# EAGLE design EthToRS485_V1_AUTO (EAGLE 6.3)
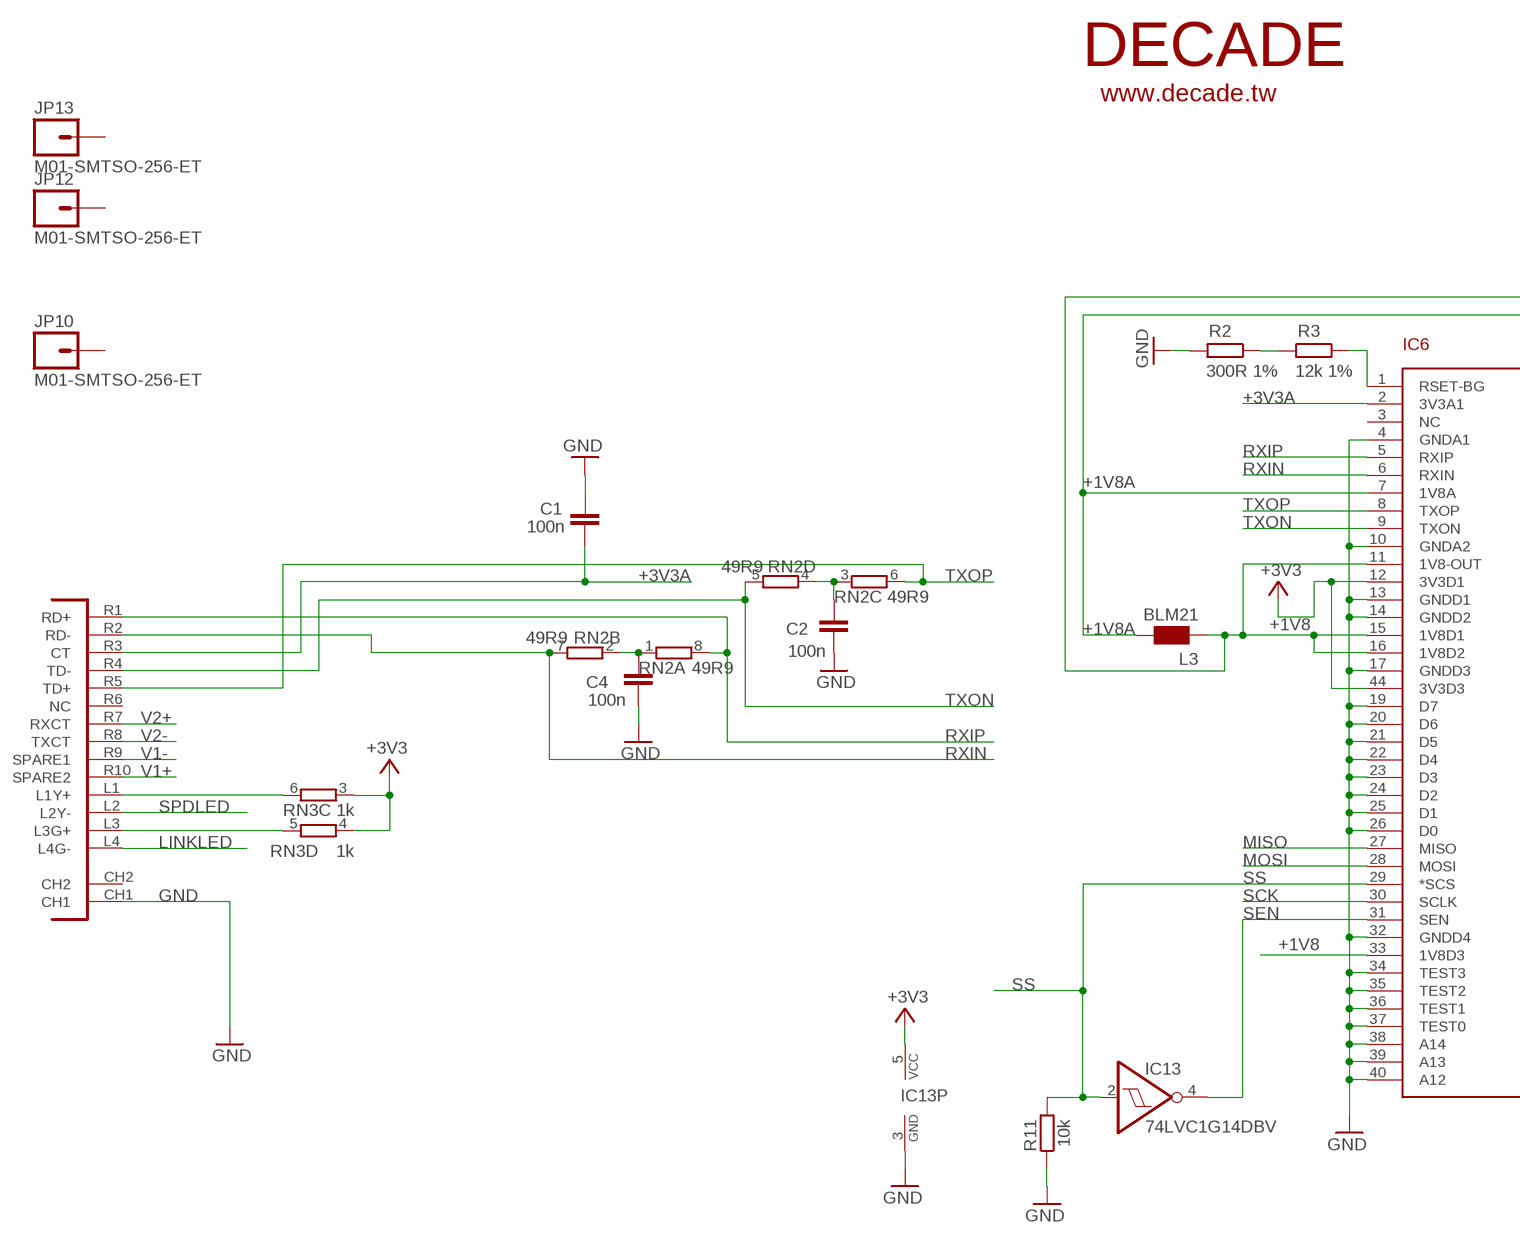
[diagram p0: schematic, sheet 1, part 1 of 3]
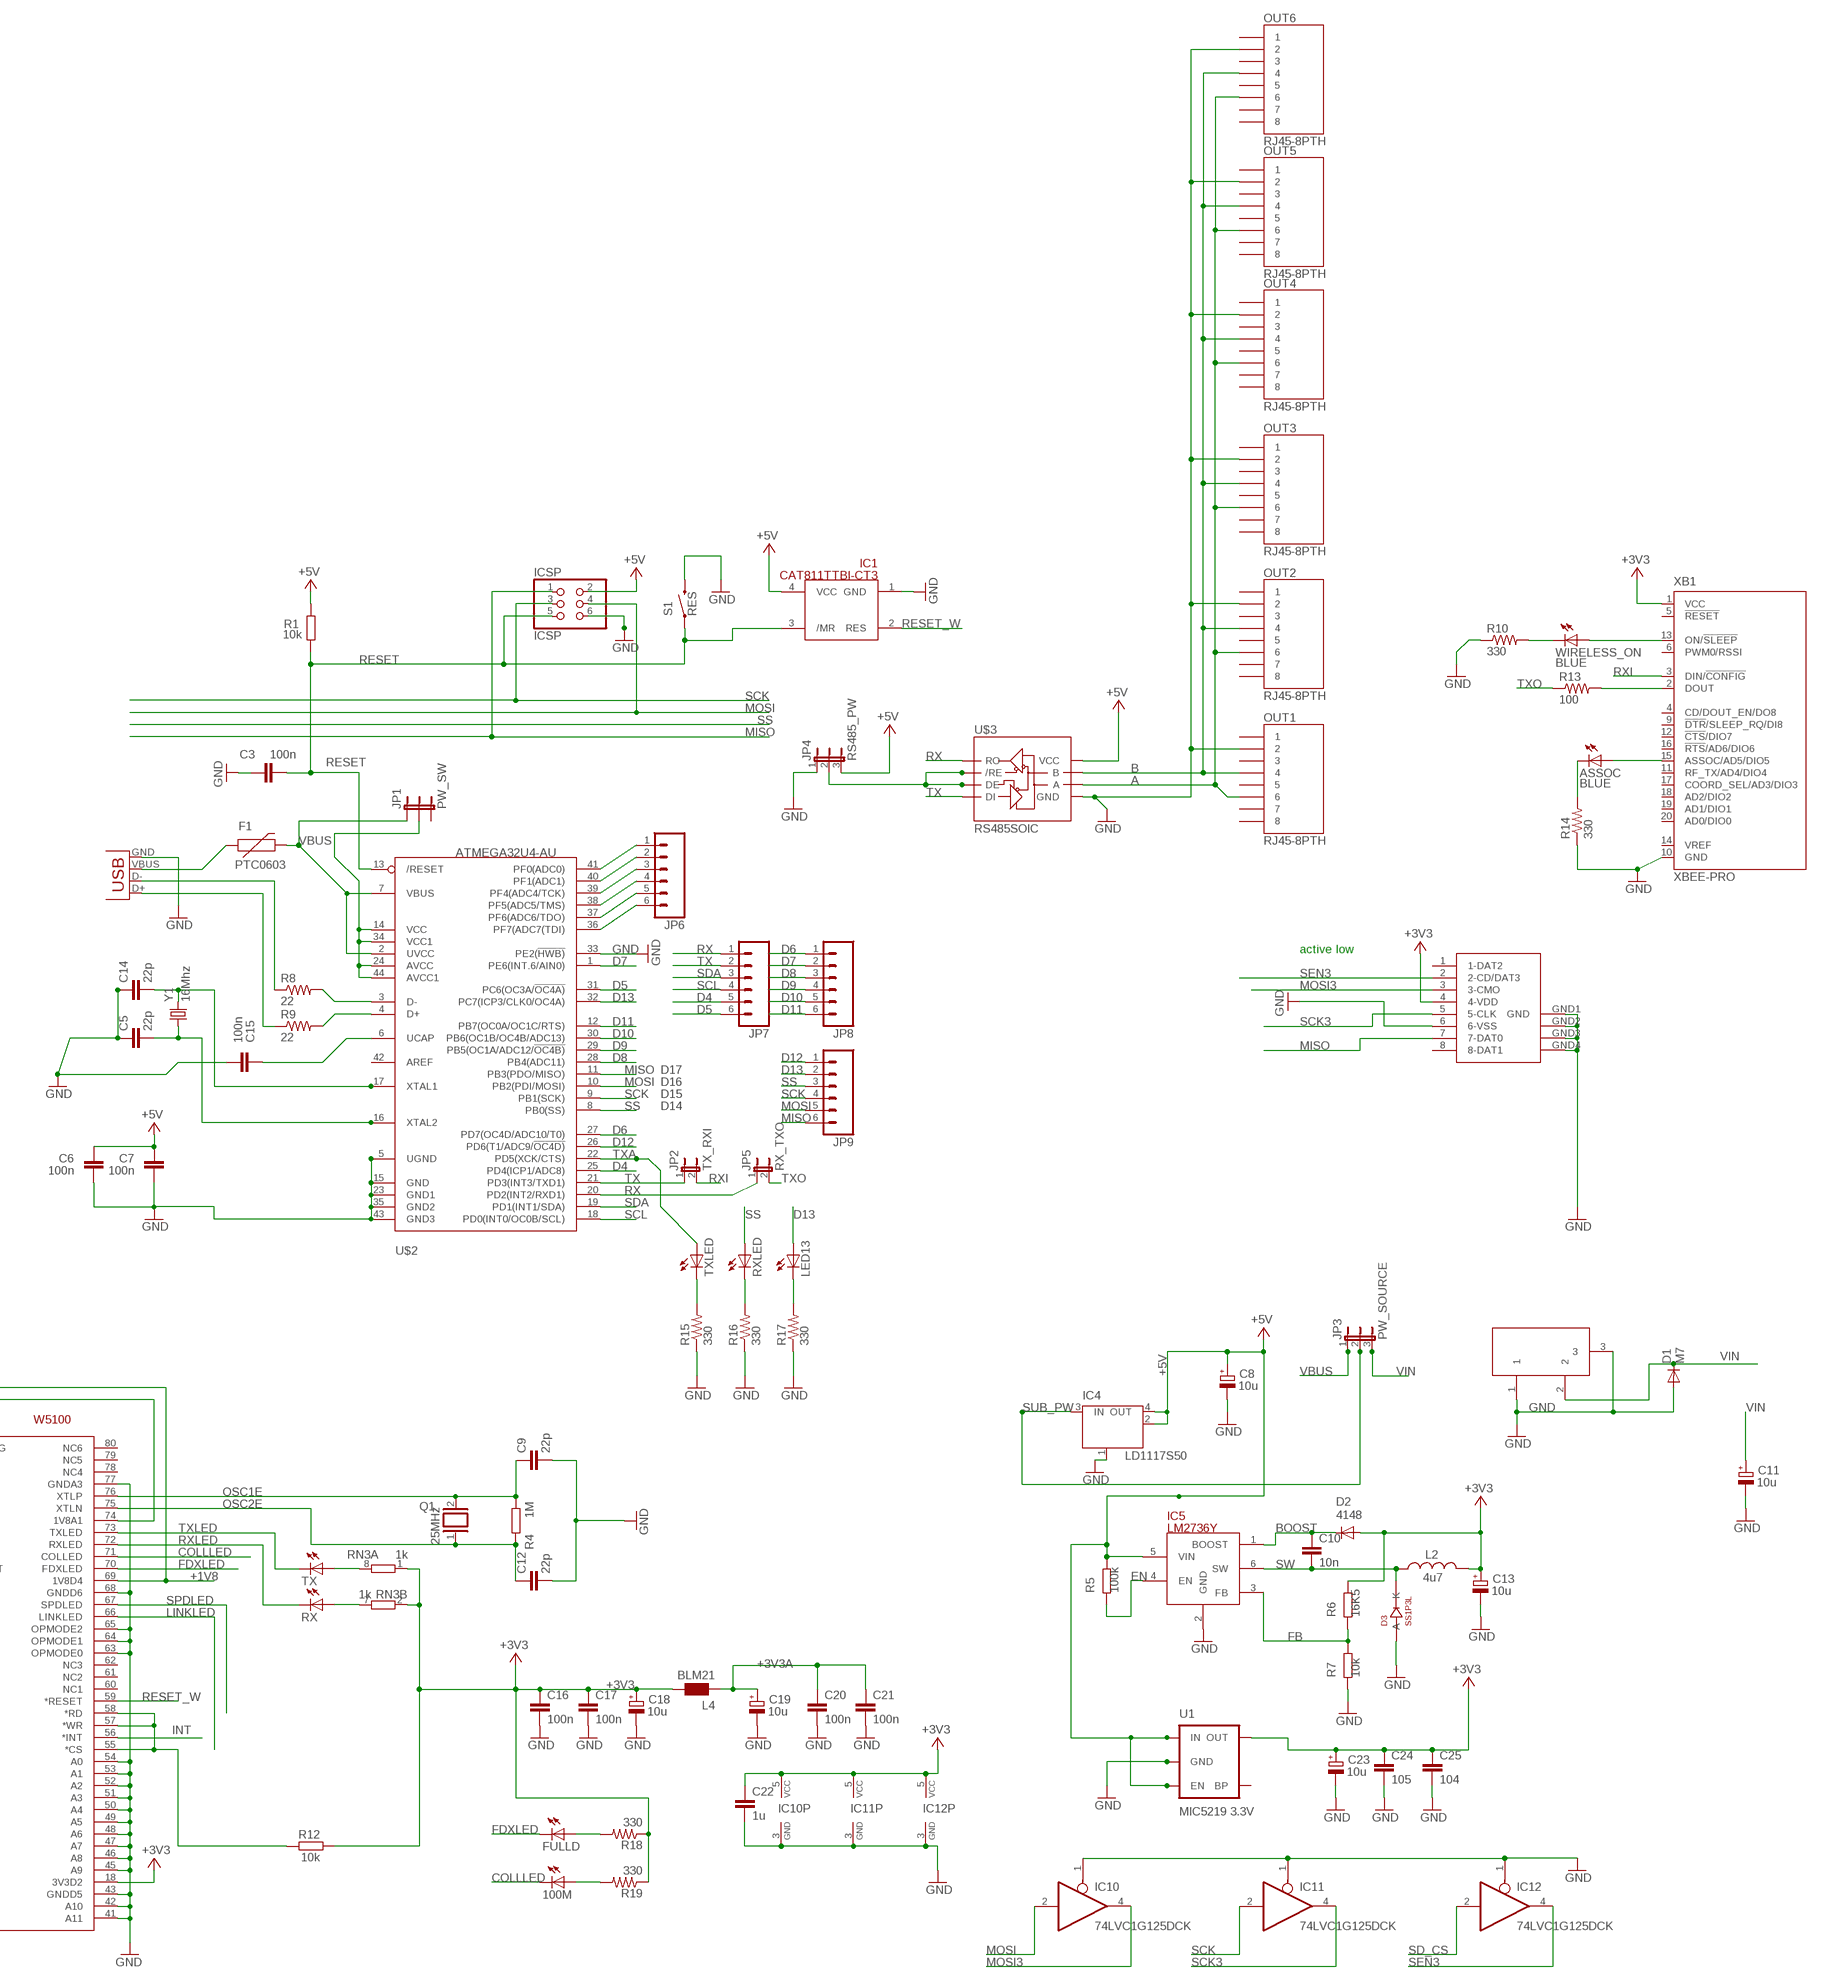
[diagram p1: schematic, sheet 1, part 2 of 3]
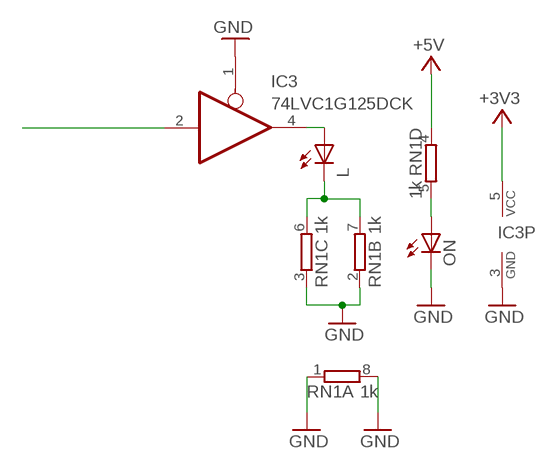
[diagram p2: schematic, sheet 1, part 3 of 3]

## Parts
100M  LEDCHIPLED_0805  [CHIPLED_0805]
ASSOC  BLUE  LEDCHIPLED_0805  [CHIPLED_0805]
C1  100n  C-EUC0603  [C0603-ROUND]
C2  100n  C-EUC0603  [C0603-ROUND]
C3  100n  C-EUC0603  [C0603-ROUND]
C4  100n  C-EUC0603  [C0603-ROUND]
C5  22p  CAP0805  [0805]
C6  100n  C-EUC0603  [C0603-ROUND]
C7  100n  C-EUC0603  [C0603-ROUND]
C8  10u  CPOL-EUSMCB  [SMC_B]
C9  22p  C-EUC0603  [C0603-ROUND]
C10  10n  C-EUC0603  [C0603-ROUND]
C11  10u  CPOL-EUSMCB  [SMC_B]
C12  22p  C-EUC0603  [C0603-ROUND]
C13  10u  CPOL-EUSMCB  [SMC_B]
C14  22p  CAP0805  [0805]
C15  100n  C-EUC0603  [C0603-ROUND]
C16  100n  C-EUC0603  [C0603-ROUND]
C17  100n  C-EUC0603  [C0603-ROUND]
C18  10u  CPOL-EUSMCB  [SMC_B]
C19  10u  CPOL-EUSMCB  [SMC_B]
C20  100n  C-EUC0603  [C0603-ROUND]
C21  100n  C-EUC0603  [C0603-ROUND]
C22  1u  C-EUC0603  [C0603-ROUND]
C23  10u  CPOL-EUSMCB  [SMC_B]
C24  105  C-EUC0603  [C0603-ROUND]
C25  104  C-EUC0603  [C0603-ROUND]
D1  M7  DIODE-SMB  [SMB]
D2  4148  DIODE-MINIMELF  [MINIMELF]
D3  SS1P3L  [DO220AAL]
F1  PTC0603  [0603]
FULLD  LEDCHIPLED_0805  [CHIPLED_0805]
IC1  CAT811TTBI-CT3  STM812  [SOT143]
IC3  74LVC1G125DCK  [SC70-5]
IC4  LD1117S50  MC33269ST-3.3T3  [SOT223]
IC5  LM2736Y  [SOT23-6]
IC6  W5100  [SQFP-S-10X10-80]
IC10  74LVC1G125DCK  [SC70-5]
IC11  74LVC1G125DCK  [SC70-5]
IC12  74LVC1G125DCK  [SC70-5]
IC13  74LVC1G14DBV  [SOT23-5]
ICSP  ICSP  PINHD-2X3  [2X03]
JP1  PW_SW  JUMPER-3SMD  [SJ_3]
JP2  TX_RXI  JP1E  [JP1]
JP3  PW_SOURCE  JP2E  [JP2]
JP4  RS485_PW  JP2E  [JP2]
JP5  RX_TXO  JP1E  [JP1]
JP6  M06SIP  [1X06]
JP7  M06SIP  [1X06]
JP8  M06SIP  [1X06]
JP9  M06SIP  [1X06]
JP10  M01-SMTSO-256-ET  [SMTSO-256-ET]
JP12  M01-SMTSO-256-ET  [SMTSO-256-ET]
JP13  M01-SMTSO-256-ET  [SMTSO-256-ET]
L  LEDCHIPLED_0805  [CHIPLED_0805]
L2  4u7  L-USSRR0604  [SRR0604]
L3  BLM21  WE-CBF_0805  [0805]
L4  BLM21  WE-CBF_0805  [0805]
LED13  LEDCHIPLED_0805  [CHIPLED_0805]
ON  LEDCHIPLED_0805  [CHIPLED_0805]
OUT1  RJ45-8PTH  [RJ45-8]
OUT2  RJ45-8PTH  [RJ45-8]
OUT3  RJ45-8PTH  [RJ45-8]
OUT4  RJ45-8PTH  [RJ45-8]
OUT5  RJ45-8PTH  [RJ45-8]
OUT6  RJ45-8PTH  [RJ45-8]
Q1  25MHz  XTAL/S  [QS]
R1  10k  R-EU_0603-RND  [R0603-ROUND]
R2  300R 1%  R-EU_0603-RND  [R0603-ROUND]
R3  12k 1%  R-EU_0603-RND  [R0603-ROUND]
R4  1M  R-EU_0603-RND  [R0603-ROUND]
R5  100k  R-EU_0603-RND  [R0603-ROUND]
R6  16K5  R-EU_0603-RND  [R0603-ROUND]
R7  10k  R-EU_0603-RND  [R0603-ROUND]
R8  22  RESISTOR0805-RES  [0805]
R9  22  RESISTOR0805-RES  [0805]
R10  330  RESISTOR0805-RES  [0805]
R11  10k  R-EU_0603-RND  [R0603-ROUND]
R12  10k  R-EU_R0603  [R0603-ROUND]
R13  100  RESISTOR0805-RES  [0805]
R14  330  RESISTOR0805-RES  [0805]
R15  330  RESISTOR0805-RES  [0805]
R16  330  RESISTOR0805-RES  [0805]
R17  330  RESISTOR0805-RES  [0805]
R18  330  RESISTOR0805-RES  [0805]
R19  330  RESISTOR0805-RES  [0805]
RN1  1k  4R-NCAY16  [CAY16]
RN2  49R9  4R-NCAY16  [CAY16]
RN3  1k  4R-NCAY16  [CAY16]
RX  LEDCHIPLED_0805  [CHIPLED_0805]
RXLED  LEDCHIPLED_0805  [CHIPLED_0805]
S1  RES  SWITCH-MOMENTARY-2-SMD-1101NE  [TACTILE-SWITCH-1101NE]
TX  LEDCHIPLED_0805  [CHIPLED_0805]
TXLED  LEDCHIPLED_0805  [CHIPLED_0805]
U1  MIC5219 3.3V  V_REG_MIC52193.3V  [SOT23-5]
U$1  POE-RJ45  [POE-RJ45]
U$2  ATMEGA32U4-AU  [TQFP44]
U$3  RS485SOIC  [SO08]
U$4  DECADE-LOGO-SMALL  [DECADE-LOGO-SMALL]
WIRELESS_ON  BLUE  LEDCHIPLED_0805  [CHIPLED_0805]
X1  DC21MMX  [DC-21MM]
X2  SDCARD-15TW-8821  [SDCARD-15TW-8821]
X3  USBOLD  [USB-MINIB-OLD]
XB1  XBEE-PRO  [XBEE-PRO]
Y1  16Mhz  CRYSTAL5X3  [CRYSTAL-SMD-5X3]

## Nets
+1V8 [power]: IC6.11(1V8-OUT) IC6.15(1V8D1) IC6.16(1V8D2) IC6.33(1V8D3) IC6.69(1V8D4) L3.1
+1V8A [power]: IC6.7(1V8A) IC6.74(1V8A1) L3.2
+3V3 [power]: C13.+ C16.1 C17.1 C18.+ C22.1 C23.+ C24.1 C25.1 D2.A IC3.5(VCC) IC6.12(3V3D1) IC6.18(3V3D2) IC6.44(3V3D3) IC10.5(VCC) IC11.5(VCC) IC12.5(VCC) IC13.5(VCC) L2.P$2 L4.2 R6.1 R12.2 R18.1 R19.1 RN3.1 RN3.2 RN3.3 RN3.4 U1.5(OUT) X2.4(4-VDD) XB1.1(VCC)
+3V3A [power]: C1.1 C19.+ C20.1 C21.1 IC6.2(3V3A1) L4.1 U$1.R3(CT)
+5V [power]: C6.1 C7.1 C8.+ IC1.4(VCC) IC4.2(OUT) IC4.4(OUT) IC5.5(VIN) ICSP.2 JP4.3 R1.2 R5.1 RN1.4 U1.1(IN) U1.3(EN) U$3.8(VCC)
A: OUT1.6 OUT2.6 OUT3.6 OUT4.6 OUT5.6 OUT6.6 U$3.6(A)
AD0: JP6.1 U$2.41(PF0(ADC0))
AD1: JP6.2 U$2.40(PF1(ADC1))
AD2: JP6.3 U$2.39(PF4(ADC4/TCK))
AD3: JP6.4 U$2.38(PF5(ADC5/TMS))
AD4: JP6.5 U$2.37(PF6(ADC6/TDO))
AD5: JP6.6 U$2.36(PF7(ADC7(TDI))
B: OUT1.4 OUT2.4 OUT3.4 OUT4.4 OUT5.4 OUT6.4 U$3.7(B)
BOOST: C10.1 D2.C IC5.1(BOOST)
COLLLED: 100M.C IC6.71(COLLED)
D4: JP7.5 U$2.25(PD4(ICP1/ADC8))
D5: JP7.6 U$2.31(PC6(OC3A/!OC4A))
D6: JP8.1 U$2.27(PD7(OC4D/ADC10/T0))
D7: JP8.2 U$2.1(PE6(INT.6/AIN0))
D8: JP8.3 U$2.28(PB4(ADC11))
D9: JP8.4 U$2.29(PB5(OC1A/ADC12/!OC4B))
D10: JP8.5 U$2.30(PB6(OC1B/OC4B/ADC13))
D11: JP8.6 U$2.12(PB7(OC0A/OC1C/RTS))
D12: JP9.1 U$2.26(PD6(T1/ADC9/!OC4D))
D13: JP9.2 LED13.A U$2.32(PC7(ICP3/CLK0/OC4A))
EN: IC5.4(EN) R5.2
FB: IC5.3(FB) R6.2 R7.1
FDXLED: FULLD.C IC6.70(FDXLED)
GND [power]: C1.2 C2.1 C3.2 C4.1 C5.1 C6.2 C7.2 C8.- C9.2 C11.- C12.2 C13.- C14.1 C15.2 C16.2 C17.2 C18.- C19.- C20.2 C21.2 C22.2 C23.- C24.2 C25.2 D1.A D3.P$2(A) IC1.1(GND) IC3.1(OE) IC3.3(GND) IC4.1(GND/ADJ) IC5.2(GND) IC6.4(GNDA1) IC6.10(GNDA2) IC6.13(GNDD1) IC6.14(GNDD2) IC6.17(GNDD3) IC6.19(D7) IC6.20(D6) IC6.21(D5) IC6.22(D4) IC6.23(D3) IC6.24(D2) IC6.25(D1) IC6.26(D0) IC6.32(GNDD4) IC6.34(TEST3) IC6.35(TEST2) IC6.36(TEST1) IC6.37(TEST0) IC6.38(A14) IC6.39(A13) IC6.40(A12) IC6.41(A11) IC6.42(A10) IC6.43(GNDD5) IC6.45(A9) IC6.46(A8) IC6.47(A7) IC6.48(A6) IC6.49(A5) IC6.50(A4) IC6.51(A3) IC6.52(A2) IC6.53(A1) IC6.54(A0) IC6.63(OPMODE0) IC6.64(OPMODE1) IC6.65(OPMODE2) IC6.68(GNDD6) IC6.77(GNDA3) IC10.1(OE) IC10.3(GND) IC11.1(OE) IC11.3(GND) IC12.1(OE) IC12.3(GND) IC13.3(GND) ICSP.6 JP4.1 ON.C OUT1.2 OUT2.2 OUT3.2 OUT4.2 OUT5.2 OUT6.2 R2.2 R7.2 R10.1 R11.1 R14.1 R15.1 R16.1 R17.1 RN1.1 RN1.2 RN1.3 RN1.8 S1.P$2 U1.2(GND) U$1.CH1 U$2.5(UGND) U$2.15(GND) U$2.23(GND1) U$2.33(PE2(!HWB)) U$2.35(GND2) U$2.43(GND3) U$3.5(GND) X1.1 X1.3 X2.6(6-VSS) X2.GND1(GND) X2.GND2(GND1) X2.GND3(GND2) X2.GND4(GND3) X3.GND XB1.10(GND)
INT: IC6.56(*INT)
LINKLED: IC6.66(LINKLED) U$1.L4(L4G-)
MISO: IC6.27(MISO) ICSP.1 JP9.6 U$2.11(PB3(PDO/MISO)) X2.7(7-DAT0)
MOSI: IC6.28(MOSI) IC10.2(I) ICSP.4 JP9.5 U$2.10(PB2(PDI/MOSI))
MOSI3: IC10.4(O) X2.3(3-CMO)
N$1: IC3.4(O) L.A
N$2: RN3.5 U$1.L3(L3G+)
N$3: RN3.6 U$1.L1(L1Y+)
N$4: IC3.2(I)
N$5: L.C RN1.6 RN1.7
N$6: C5.2 U$2.16(XTAL2) Y1.1
N$7: C14.2 U$2.17(XTAL1) Y1.3
N$8: ON.A RN1.5
N$9: RN3.8 TX.A
N$10: C2.2 RN2.3 RN2.4
N$11: R8.2 U$2.3(D-)
N$12: R9.2 U$2.4(D+)
N$13: R8.1 X3.D-
N$14: R9.1 X3.D+
N$15: F1.1 X3.VBUS
N$16: R15.2 TXLED.C
N$17: R13.2 XB1.2(DOUT)
N$18: C15.1 U$2.6(UCAP)
N$19: JP1.2 U$2.14(VCC) U$2.24(AVCC) U$2.34(VCC1) U$2.44(AVCC1)
N$20: R10.2 WIRELESS_ON.C
N$21: JP4.2 U$3.2(/RE) U$3.3(DE)
N$22: RN3.7 RX.A
N$23: WIRELESS_ON.A XB1.13(ON/!SLEEP)
N$24: ASSOC.A XB1.15(ASSOC/AD5/DIO5)
N$25: ASSOC.C R14.2
N$26: FULLD.A R18.2
N$29: C4.2 RN2.1 RN2.2
N$30: R2.1 R3.2
N$31: IC6.1(RSET-BG) R3.1
N$36: IC6.55(*CS) IC6.57(*WR) IC6.58(*RD) R12.1
N$37: R16.2 RXLED.C
N$38: LED13.C R17.2
N$39: 100M.A R19.2
OSC1E: C9.1 IC6.76(XTLP) Q1.2 R4.1
OSC2E: C12.1 IC6.75(XTLN) Q1.1 R4.2
RESET: C3.1 IC1.3(/MR) ICSP.5 R1.1 S1.P$1 U$2.13(/RESET)
RESET_W: IC1.2(RES) IC6.59(*RESET)
RX: JP5.1 JP7.1 U$2.20(PD2(INT2/RXD1)) U$3.1(RO)
RXI: JP2.2 XB1.3(DIN/!CONFIG)
RXIN: IC6.6(RXIN) RN2.7 U$1.R2(RD-)
RXIP: IC6.5(RXIP) RN2.8 U$1.R1(RD+)
RXLED: IC6.72(RXLED) RX.C
SCK: IC6.30(SCLK) IC11.2(I) ICSP.3 JP9.4 U$2.9(PB1(SCK))
SCK3: IC11.4(O) X2.5(5-CLK)
SCL: JP7.4 U$2.18(PD0(INT0/OC0B/SCL))
SD_CS: IC12.2(I)
SDA: JP7.3 U$2.19(PD1(INT1/SDA))
SEN: IC6.31(SEN) IC13.4(O)
SEN3: IC12.4(O) X2.2(2-CD/DAT3)
SPDLED: IC6.67(SPDLED) U$1.L2(L2Y-)
SS: IC6.29(*SCS) IC13.2(I) JP9.3 R11.2 RXLED.A U$2.8(PB0(SS))
SUB_PW [VIN]: IC4.3(IN) JP3.2
SW [power]: C10.2 D3.P$1(K) IC5.6(SW) L2.P$1
TX: JP2.1 JP7.2 U$2.21(PD3(INT3/TXD1)) U$3.4(DI)
TXA: TXLED.A U$2.22(PD5(XCK/CTS))
TXLED: IC6.73(TXLED) TX.C
TXO: JP5.2 R13.1
TXON: IC6.9(TXON) RN2.5 U$1.R4(TD-)
TXOP: IC6.8(TXOP) RN2.6 U$1.R5(TD+)
V1+ [VIN]: U$1.R10(SPARE2)
V1- [VIN]: U$1.R9(SPARE1)
V2+ [VIN]: U$1.R7(RXCT)
V2- [VIN]: U$1.R8(TXCT)
VBUS: F1.2 JP1.1 JP3.1 U$2.2(UVCC) U$2.7(VBUS)
VIN [VIN]: C11.+ D1.C JP3.3 X1.2
Unconnected: IC6.3(NC) IC6.60(NC1) IC6.61(NC2) IC6.62(NC3) IC6.78(NC4) IC6.79(NC5) IC6.80(NC6) JP1.3 JP10.P$1 JP12.P$1 JP13.P$1 OUT1.1 OUT1.3 OUT1.5 OUT1.7 OUT1.8 OUT2.1 OUT2.3 OUT2.5 OUT2.7 OUT2.8 OUT3.1 OUT3.3 OUT3.5 OUT3.7 OUT3.8 OUT4.1 OUT4.3 OUT4.5 OUT4.7 OUT4.8 OUT5.1 OUT5.3 OUT5.5 OUT5.7 OUT5.8 OUT6.1 OUT6.3 OUT6.5 OUT6.7 OUT6.8 U1.4(BP) U$1.CH2 U$1.R6(NC) U$2.42(AREF) X2.1(1-DAT2) X2.8(8-DAT1) XB1.4(CD/DOUT_EN/DO8) XB1.5(!RESET) XB1.6(PWM0/RSSI) XB1.9(!DTR!/SLEEP_RQ/DI8) XB1.11(RF_TX/AD4/DIO4) XB1.12(!CTS!/DIO7) XB1.14(VREF) XB1.16(!RTS!/AD6/DIO6) XB1.17(COORD_SEL/AD3/DIO3) XB1.18(AD2/DIO2) XB1.19(AD1/DIO1) XB1.20(AD0/DIO0)

## Notes on the sheet
- active low
- D17
- D16
- D15
- D14

## Library data of the parts
100M ASSOC FULLD L LED13 ON RX RXLED TX TXLED WIRELESS_ON = led:LED: LED OSRAM: - CHIPLED LG R971, LG N971, LY N971, LG Q971, LY Q971, LO R971, LY R971 LH N974, LH R974 LS Q976, LO Q976, LY Q976 LO Q996 - Hyper CHIPLED LW Q18S LB Q993, LB Q99A, LB R99A - SideLED LS A670, LO A670, LY A670, LG A670, LP A670 LB A673, LV A673, LT A673, LW A673 LH A674 LY A675 LS A676, LA A676, LO A676, LY A676, LW A676 LS A679, LY A679, LG A679 - Hyper Micro SIDELED® LS Y876, LA Y876, LO Y876, LY Y876 LT Y87S - SmartLED LW L88C, LW L88S LB L89C, LB L89S, LG L890 LS L89K, LO L89K, LY L89K LS L896, LA L896, LO L896, LY L896 - TOPLED LS T670, LO T670, LY T670, LG T670, LP T670 LSG T670, LSP T670, LSY T670, LOP T670, LYG T670 LG T671, LOG T671, LSG T671 LB T673, LV T673, LT T673, LW T673 LH T674 LS T676, LA T676, LO T676, LY T676, LB T676, LH T676, LSB T676, LW T676 LB T67C, LV T67C, LT T67C, LS T67K, LO T67K, LY T67K, LW E67C LS E67B, LA E67B, LO E67B, LY E67B, LB E67C, LV E67C, LT E67C LW T67C LS T679, LY T679, LG T679 LS T770, LO T770, LY T770, LG T770, LP T770 LB T773, LV T773, LT T773, LW T773 LH T774 LS E675, LA E675, LY E675, LS T675 LS T776, LA T776, LO T776, LY T776, LB T776 LHGB T686 LT T68C, LB T68C - Hyper Mini TOPLED® LB M676 - Mini TOPLED Santana® LG M470 LS M47K, LO M47K, LY M47K Source: http://www.osram.convergy.de LUXEON: - LUMILED® LXK2-PW12-R00, LXK2-PW12-S00, LXK2-PW14-U00, LXK2-PW14-V00 LXK2-PM12-R00, LXK2-PM12-S00, LXK2-PM14-U00 LXK2-PE12-Q00, LXK2-PE12-R00, LXK2-PE12-S00, LXK2-PE14-T00, LXK2-PE14-U00 LXK2-PB12-K00, LXK2-PB12-L00, LXK2-PB12-M00, LXK2-PB14-N00, LXK2-PB14-P00, LXK2-PB14-Q00 LXK2-PR12-L00, LXK2-PR12-M00, LXK2-PR14-Q00, LXK2-PR14-R00 LXK2-PD12-Q00, LXK2-PD12-R00, LXK2-PD12-S00 LXK2-PH12-R00, LXK2-PH12-S00 LXK2-PL12-P00, LXK2-PL12-Q00, LXK2-PL12-R00 Source: www.luxeon.com KINGBRIGHT: KA-3528ASYC Source: www.kingbright.com
C1-C4 C6 C7 C9 C10 C12 C15-C17 C20-C22 C24 C25 = SmartPrj:C-EU: CAPACITOR, European symbol
C5 C14 = SparkFun-Passives:CAP: Capacitor Standard 0603 ceramic capacitor, and 0.1" leaded capacitor.
C8 C11 C13 C18 C19 C23 = rcl:CPOL-EU: POLARIZED CAPACITOR, European symbol
D1 D2 = diode:DIODE-: DIODE
D3 = SmartPrj:SS1P3L
F1 = SparkFun-PowerIC:PTC: Resettable Fuse PTC Resettable Fuse. Spark Fun Electronics SKU : COM-08357
IC1 = SmartPrj:STM812
IC3 IC10-IC12 = 74xx-little-us:74*1G125: Single Bus Buffer Gate with 3-State Output
IC4 = linear:MC33269ST*: Adjustable Output Low Dropout Voltage Regulator 800 mA Source: http://www.onsemi.com/pub/Collateral/MC33269-D.PDF
IC5 = SmartPrj:LM2736Y
IC6 = SmartPrj:W5100
IC13 = 74xx-little-de:74*1G14: Single Schmitt-Trigger Inverter Gate
ICSP = pinhead:PINHD-2X3: PIN HEADER
JP1 = SparkFun-Passives:JUMPER-3
JP2 JP5 = jumper:JP1E: JUMPER
JP3 JP4 = jumper:JP2E: JUMPER
JP6-JP9 = SparkFun-Connectors:M06: Header 6 Standard 6-pin 0.1" header. Use with straight break away headers (SKU : PRT-00116), right angle break away headers (PRT-00553), swiss pins (PRT-00743), machine pins (PRT-00117), and female headers (PRT-00115). Molex polarized connector foot print use with SKU : PRT-08094 with associated crimp pins and housings. NOTES ON THE VARIANTS LOCK and LOCK_LONGPADS... This footprint was designed to help hold the alignment of a through-hole component (i.e. 6-pin header) while soldering it into place. You may notice that each hole has been shifted either up or down by 0.005 of an inch from it's more standard position (which is a perfectly straight line). This slight alteration caused the pins (the squares in the middle) to touch the edges of the holes. Because they are alternating, it causes a "brace" to hold the component in place. 0.005 has proven to be the perfect amount of "off-center" position when using our standard breakaway headers. Although looks a little odd when you look at the bare footprint, once you have a header in there, the alteration is very hard to notice. Also, if you push a header all the way into place, it is covered up entirely on the bottom side. This idea of altering the position of holes to aid alignment will be further integrated into the Sparkfun Library for other footprints. It can help hold any component with 3 or more connection pins.
JP10 JP12 JP13 = SparkFun-Connectors:M01: Header 1 Standard 1-pin 0.1" header. Use with straight break away headers (SKU : PRT-00116), right angle break away headers (PRT-00553), swiss pins (PRT-00743), machine pins (PRT-00117), and female headers (PRT-00115).
L2 = SmartPrj:L-US: INDUCTOR, American symbol
L3 L4 = wuerth-elektronik:WE-CBF: SMD EMI Suppression Ferrite Beads - excellent anti-EMI properties - low DCR - impedances till 3000 ohms - rated current up to 6 A
OUT1-OUT6 = SparkFun-Connectors:RJ45-8: RJ45 Jack Simple RJ45, 8-pin connection - connector for common Cat5, Cat5e, and Cat6 Ethernet cables. Footprint not yet proven in production. Connector sku is PRT-00643; Breakout PCB sku is BOB-00716.
Q1 = special:XTAL/S: CRYSTAL
R1-R7 R11 R12 = SmartPrj:R-EU_: RESISTOR, European symbol
R8-R10 R13-R19 = SparkFun-Passives:RESISTOR: Resistor Basic schematic elements and footprints for 0603, 1206, and PTH resistors.
RN1-RN3 = resistor-dil:4R-N: Array Chip Resistor Source: RS Component / Phycomp
S1 = SparkFun-Electromechanical:SWITCH-MOMENTARY-2: Various NO switches- pushbuttons, reed, etc
U1 = SparkFun-PowerIC:V_REG_MIC5219: V_REG MIC5219 Standard 500mA LDO voltage regulator in SOT-23 layout. Micrel part MIC5219. BP (by-pass) pin is used to lower output noise with 470pF cap, may be left open.; PROD_ID: VREG-09872
U$1 = SmartPrj:POE-RJ45
U$2 = adafruit:ATMEGA32U4: http://www.ladyada.net/library/eagle
U$3 = SparkFun-DigitalIC:RS485: RS485 transceiver
U$4 = DECADE-libraries:DECADE-LOGO-SMALL
X1 = powersupply:DC21MM
X2 = st-mod v1.3:SDCARD-15TW-8821: SD Card SDCARD 15TW 8821
X3 = SparkFun-Connectors:USB: USB Connectors USB-B-PTH is fully proven SKU : PRT-00139 USB-miniB is fully proven SKU : PRT-00587 USB-A-PCB is untested. USB-A-H is throughly reviewed, but untested. Spark Fun Electronics SKU : PRT-00437 USB-B-SMT is throughly reviewed, but untested. Needs silkscreen touching up. USB-A-S has not been used/tested USB-MB-H has not been used/tested
XB1 = maxstream:XBEE: XBee (TM) /XBee-PRO(TM) OEM RF Modules Source: MaxStream, Inc. xbee_productmanual.pdf; MPN: XBP24-AWI-001; OC_FARNELL: 1337916; OC_NEWARK: 42M2667
Y1 = SparkFun-FreqCtrl:CRYSTAL: Various standard crystals. Proven footprints. Spark Fun Electronics SKU : COM-00534

## Net classes
0 default: width 0.152 mm, drill 0.152 mm, clearance 0.152 mm
1 power: width 0.152 mm, drill 0.152 mm, clearance 0.152 mm
2 VIN: width 0.152 mm, drill 0.152 mm, clearance 0.305 mm

## Board
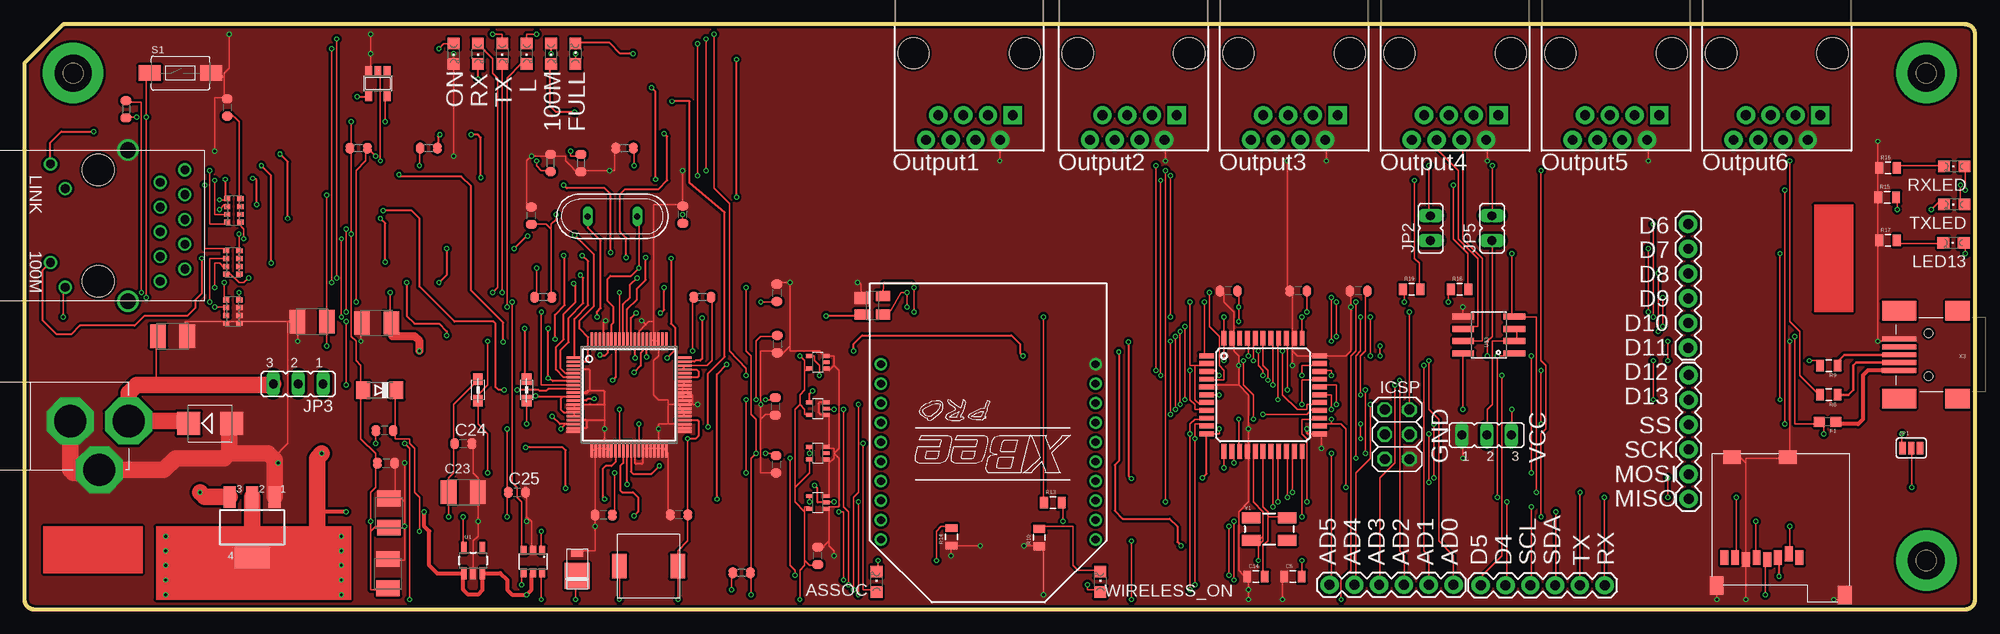
[diagram p3: board, top side]
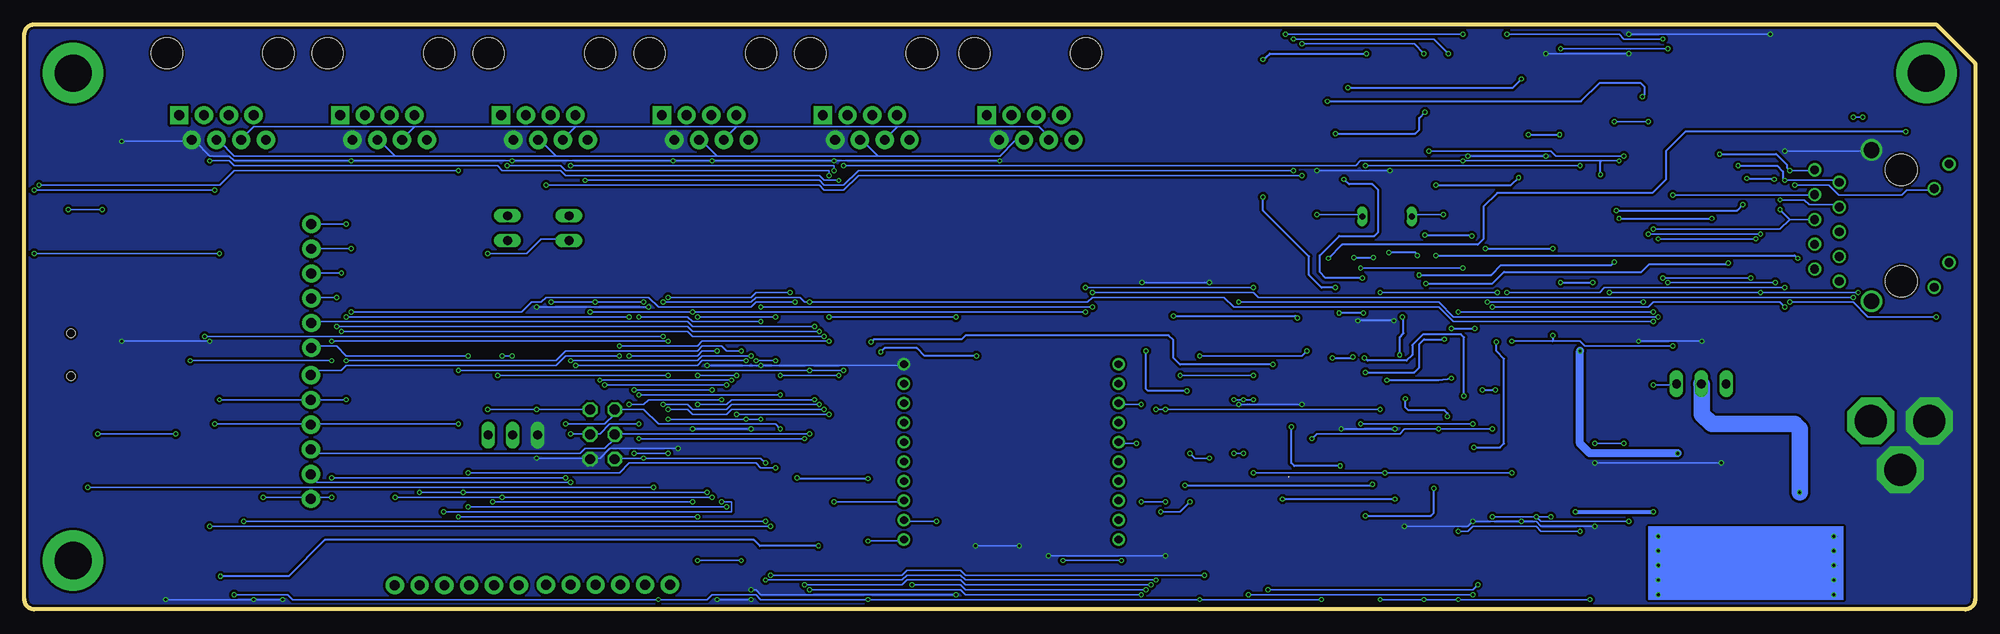
[diagram p4: board, bottom side, seen from below]

Size 200 x 60 mm. Coordinates in mm from the lower left corner, seen from the top.
Outline: 0,56 0,1 arc90 1,0 199,0 arc90 200,1 200,59 arc90 199,60 4,60 0,56
Copper layers (1*16): Top 0.035mm / dielectric 1.5mm / Bottom 0.035mm
Design rules "Fast_ChinaPCB-2012-6mil-off-MASK": minimum track width 6mil, minimum drill 0.3mm, track to track 6mil, track to pad 6mil, pad to pad 6mil, via to via 6mil, smd to smd 6mil, copper to edge 10mil, drill to drill 15mil, minimum pad ring 8mil, minimum via ring 4mil, stop-mask expansion 2mil, vias tented up to drill 13mil, thermal gap 10mil

### Footprints (pad centres in the part's own frame; a part is rotated, then mirrored left to right if it is on the bottom)
CHIPLED_0805 = smd 1.2 x 1.2: A 0,-1.05; C 0,1.05
C0603-ROUND = smd 0.898 x 1.1: 1 -0.889,0; 2 0.889,0
0805 = smd 0.8 x 1.2: 1 -0.9,0; 2 0.9,0
SMC_B = smd 1.6 x 2.4: + -1.5,0; - 1.5,0
SMB = smd 2.4 x 2.4: A 2.2,0; C -2.2,0
MINIMELF = smd 1.4 x 1.8: A 1.7,0; C -1.7,0
DO220AAL = smd 2.667 x 2.54: P$1 -0.7,0 | smd 0.762 x 1.27: P$2 1.65,0
0603 = smd 1.1 x 1: 1 -0.85,0; 2 0.85,0
SOT143 = smd 1.2 x 1.44: 1 -0.75,-1.1 | smd 1 x 1.44: 2 0.95,-1.1; 3 0.95,1.1; 4 -0.95,1.1
SC70-5 = smd 0.4 x 0.7: 1 -0.65,-0.85; 2 0,-0.85; 3 0.65,-0.85; 4 0.65,0.85; 5 -0.65,0.85
SOT223 = smd 1.219 x 2.235: 1 -2.311,-3.099; 2 0,-3.099; 3 2.311,-3.099 | smd 3.6 x 2.2: 4 0,3.099
SOT23-6 = smd 0.6 x 0.9: 1 -0.95,-1.15; 2 0,-1.15; 3 0.95,-1.15; 4 0.95,1.15; 5 0,1.15; 6 -0.95,1.15
SQFP-S-10X10-80 = smd 0.25 x 1.6: 1 -3.8,-5.6; 2 -3.4,-5.6; 3 -3,-5.6; 4 -2.6,-5.6; 5 -2.2,-5.6; 6 -1.8,-5.6; 7 -1.4,-5.6; 8 -1,-5.6; 9 -0.6,-5.6; 10 -0.2,-5.6; 11 0.2,-5.6; 12 0.6,-5.6; 13 1,-5.6; 14 1.4,-5.6; 15 1.8,-5.6; 16 2.2,-5.6; 17 2.6,-5.6; 18 3,-5.6; 19 3.4,-5.6; 20 3.8,-5.6; 41 3.8,5.6; 42 3.4,5.6; 43 3,5.6; 44 2.6,5.6; 45 2.2,5.6; 46 1.8,5.6; 47 1.4,5.6; 48 1,5.6; 49 0.6,5.6; 50 0.2,5.6; 51 -0.2,5.6; 52 -0.6,5.6; 53 -1,5.6; 54 -1.4,5.6; 55 -1.8,5.6; 56 -2.2,5.6; 57 -2.6,5.6; 58 -3,5.6; 59 -3.4,5.6; 60 -3.8,5.6 | smd 1.6 x 0.25: 21 5.6,-3.8; 22 5.6,-3.4; 23 5.6,-3; 24 5.6,-2.6; 25 5.6,-2.2; 26 5.6,-1.8; 27 5.6,-1.4; 28 5.6,-1; 29 5.6,-0.6; 30 5.6,-0.2; 31 5.6,0.2; 32 5.6,0.6; 33 5.6,1; 34 5.6,1.4; 35 5.6,1.8; 36 5.6,2.2; 37 5.6,2.6; 38 5.6,3; 39 5.6,3.4; 40 5.6,3.8; 61 -5.6,3.8; 62 -5.6,3.4; 63 -5.6,3; 64 -5.6,2.6; 65 -5.6,2.2; 66 -5.6,1.8; 67 -5.6,1.4; 68 -5.6,1; 69 -5.6,0.6; 70 -5.6,0.2; 71 -5.6,-0.2; 72 -5.6,-0.6; 73 -5.6,-1; 74 -5.6,-1.4; 75 -5.6,-1.8; 76 -5.6,-2.2; 77 -5.6,-2.6; 78 -5.6,-3; 79 -5.6,-3.4; 80 -5.6,-3.8
SOT23-5 = smd 0.69 x 0.99: 1 -0.95,-1.29; 2 0,-1.29; 3 0.95,-1.29; 4 0.95,1.3; 5 -0.95,1.3
2X03 = drill 1.016 octagon: 1 -2.54,-1.27; 2 -2.54,1.27; 3 0,-1.27; 4 0,1.27; 5 2.54,-1.27; 6 2.54,1.27
SJ_3 = smd 0.635 x 1.27: 1 -0.889,0; 2 0,0; 3 0.889,0
JP1 = drill 0.914 long: 1 0,-1.27; 2 0,1.27
JP2 = drill 0.914 long: 1 -2.54,0; 2 0,0; 3 2.54,0
1X06 = drill 1.016 pad 1.88: 1 0,0; 2 2.54,0; 3 5.08,0; 4 7.62,0; 5 10.16,0; 6 12.7,0
SMTSO-256-ET = drill 3.81 pad 6.198: P$1 0,0
SRR0604 = smd 1.5 x 2.5: P$1 3,0; P$2 -3,0
0805' = smd 1.2 x 1: 1 -1.1,0; 2 1.1,0
RJ45-8 = drill 1 pad 1.88 square: 1 -4.445,6.35 | drill 1 pad 1.88: 2 -3.175,8.89; 3 -1.905,6.35; 4 -0.635,8.89; 5 0.635,6.35; 6 1.905,8.89; 7 3.175,6.35; 8 4.445,8.89 | hole 3.2: -5.715,0; 5.715,0
QS = drill 0.61 long: 1 -2.54,0; 2 2.54,0
R0603-ROUND = smd 0.898 x 1.1: 1 -0.889,0; 2 0.889,0
CAY16 = smd 0.5 x 0.65: 1 -1.2,-0.675; 2 -0.4,-0.675; 3 0.4,-0.675; 4 1.2,-0.675; 5 1.2,0.675; 6 0.4,0.675; 7 -0.4,0.675; 8 -1.2,0.675
TACTILE-SWITCH-1101NE = smd 2.3 x 1.6: P$1 -3.15,0; P$2 3.15,0
SOT23-5' = smd 0.55 x 1.2: 1 -0.95,-1.3; 2 0,-1.3; 3 0.95,-1.3; 4 0.95,1.3; 5 -0.95,1.3
POE-RJ45 = drill 1.6: CH1 13.94,7.75; CH2 13.94,-7.75 | drill 0.9: L1 7.51,-6.325; L2 5.99,-3.785; L3 7.51,3.785; L4 5.99,6.325; R1 19.77,5.715; R2 17.23,4.445; R3 19.77,3.175; R4 17.23,1.905; R5 19.77,0.635; R6 17.23,-0.635; R7 19.77,-1.905; R8 17.23,-3.175; R9 19.77,-4.445; R10 17.23,-5.715 | hole 3.25: 10.89,5.715; 10.89,-5.715
TQFP44 = smd 1.5 x 0.5: 1 -5.8,4; 2 -5.8,3.2; 3 -5.8,2.4; 4 -5.8,1.6; 5 -5.8,0.8; 6 -5.8,0; 7 -5.8,-0.8; 8 -5.8,-1.6; 9 -5.8,-2.4; 10 -5.8,-3.2; 11 -5.8,-4; 23 5.8,-4; 24 5.8,-3.2; 25 5.8,-2.4; 26 5.8,-1.6; 27 5.8,-0.8; 28 5.8,0; 29 5.8,0.8; 30 5.8,1.6; 31 5.8,2.4; 32 5.8,3.2; 33 5.8,4 | smd 0.5 x 1.5: 12 -4,-5.8; 13 -3.2,-5.8; 14 -2.4,-5.8; 15 -1.6,-5.8; 16 -0.8,-5.8; 17 0,-5.8; 18 0.8,-5.8; 19 1.6,-5.8; 20 2.4,-5.8; 21 3.2,-5.8; 22 4,-5.8; 34 4,5.8; 35 3.2,5.8; 36 2.4,5.8; 37 1.6,5.8; 38 0.8,5.8; 39 0,5.8; 40 -0.8,5.8; 41 -1.6,5.8; 42 -2.4,5.8; 43 -3.2,5.8; 44 -4,5.8
SO08 = smd 0.61 x 2.21: 1 -1.905,-2.616; 2 -0.635,-2.616; 3 0.635,-2.616; 4 1.905,-2.616; 5 1.905,2.616; 6 0.635,2.616; 7 -0.635,2.616; 8 -1.905,2.616
DC-21MM = drill 3.302 pad 4.826 octagon: 1 -5.08,-3.353; 2 -0.076,-6.35; 3 -0.076,-0.356
SDCARD-15TW-8821 = smd 0.8 x 1.5: 1 0,0; 2 1.1,-0.4; 3 2.2,0; 4 3.3,0.2; 5 4.4,0; 6 5.5,0.2; 7 6.6,0; 8 7.7,0 | smd 1.4 x 1.9: GND1 -4.66,3.85; GND2 8.49,2.85 | smd 1.8 x 1.4: GND3 1.19,-10.3; GND4 6.89,-10.3
USB-MINIB-OLD = smd 2.5 x 2: 1 -3,-4.5; 2 -3,4.5 | smd 3.5 x 2: 3 3,-4.5; 4 3,4.5 | smd 3.5 x 0.5: D+ 3,0; D- 3,0.8; GND 3,-1.6; ID 3,-0.8; VBUS 3.01,1.61 | hole 0.9: 0,2.2; 0,-2.2
XBEE-PRO = drill 0.8 pad 1.27: 1 -11,9; 2 -11,7; 3 -11,5; 4 -11,3; 5 -11,1; 6 -11,-1; 7 -11,-3; 8 -11,-5; 9 -11,-7; 10 -11,-9; 11 11,-9; 12 11,-7; 13 11,-5; 14 11,-3; 15 11,-1; 16 11,1; 17 11,3; 18 11,5; 19 11,7; 20 11,9
CRYSTAL-SMD-5X3 = smd 1.9 x 1.1: 1 -1.85,-1.15; 2 1.85,-1.15; 3 1.85,1.15; 4 -1.85,1.15

### Placement (x,y rotation side)
100M  54,57 180 top
ASSOC  87.37,2.82 0 top
C1  59.4,9.67 180 top
C2  20.8,51.46 270 top
C3  123.47,32.65 180 top
C4  77.14,32.46 270 top
C5  130.06,3.35 0 top
C6  77.08,14.87 270 top
C7  130.61,32.65 180 top
C8  36.11,29.36 180 top
C9  51.99,40.38 90 top
C10  36.93,18.32 180 top
C11  15.2,28.03 0 top
C12  67.51,40.48 90 top
C13  37.37,9.88 90 top
C14  126.27,3.35 0 top
C15  136.8,32.65 180 top
C16  37.07,15 0 top
C17  67.12,9.69 180 top
C18  37.29,3.65 90 top
C19  29.5,29.5 180 top
C20  77.19,27.19 270 top
C21  76.99,20.81 270 top
C22  81.34,5.48 90 top
C23  45,12 0 top
C24  45,17 0 top
C25  50.5,12 0 top
D1  19.05,19.07 0 top
D2  36.44,22.47 180 top
D3  56.67,4.13 90 top
F1  184.87,19.22 180 top
FULLD  56.5,57 0 top
IC1  86.93,31.19 270 top
IC3  81.35,25.35 90 top
IC4  23.35,8.41 180 top
IC5  52.15,4.89 180 top
IC6  62,22 270 top
IC10  81.35,20.57 90 top
IC11  81.35,10.95 90 top
IC12  81.35,16.02 90 top
IC13  36.25,53.94 180 top
ICSP  140.74,17.94 270 top
JP1  193.46,16.54 0 top
JP2  144.17,39.09 0 top
JP3  28.07,23.13 180 top
JP4  149.93,17.87 0 top
JP5  150.47,39.09 0 top
JP6  146.52,2.51 180 top
JP7  162.02,2.46 180 top
JP8  170.58,39.52 270 top
JP9  170.63,24.02 270 top
JP10  195,5 0 top
JP12  195,55 0 top
JP13  5,55 0 top
L  51.5,57 180 top
L2  64,4.42 180 top
L3  BLM21  [0805']  51.5,22.5 90 top
L4  BLM21  [0805']  46.5,22.5 90 top
LED13  197.79,37.59 90 top
ON  44,57 180 top
OUT1  96.88,57.03 180 top
OUT2  113.7,57.03 180 top
OUT3  130.19,57.03 180 top
OUT4  146.69,57.03 180 top
OUT5  163.18,57.03 180 top
OUT6  179.68,57.03 180 top
Q1  60.3,40.3 180 top
R1  10.43,51.28 90 top
R2  61.54,47.31 180 top
R3  41.46,47.31 180 top
R4  53.2,32.01 180 top
R5  73.53,3.74 180 top
R6  34.27,47.29 0 top
R7  57.06,45.77 270 top
R8  185,22 180 top
R9  185,25 180 top
R10  104.05,7.37 90 top
R11  53.94,45.77 270 top
R12  69.53,32.01 180 top
R13  105.44,10.95 0 top
R14  95.05,7.43 90 top
R15  190.99,42.27 0 top
R16  191.07,45.27 0 top
R17  191.07,37.84 0 top
R18  147.15,32.84 0 top
R19  142.22,32.84 0 top
RN1  21.37,30.54 90 top
RN2  21.46,40.91 90 top
RN3  21.37,35.58 90 top
RX  46.5,57 180 top
RXLED  197.86,45.43 90 top
S1  16,55 0 top
TX  49,57 180 top
TXLED  197.86,41.53 90 top
U1  MIC5219 3.3V  [SOT23-5']  46,5 0 top
U$1  -3.32,39.35 0 top
U$2  127,22 0 top
U$3  150.14,28.14 90 top
U$4  1.98,3.63 0 top
WIRELESS_ON  110.31,2.82 0 top
X1  4.33,19.38 90 top
X2  181.99,5.29 180 top
X3  195.21,26.11 180 top
XB1  98.82,16.14 180 top
Y1  127.63,8.22 0 top

### Tracks (layer width: path | path; a pad name or v marks a point on that pad's centre or on a via)
+1V8  (via drill 0.3)
  Top 0.152: v51.5,19 L3.1 | IC6.33 v63,19
  Top 0.2: IC6.11 55.2,21.8 55,21.6 55,20.5 55.3,20.2 IC6.15 IC6.16 | IC6.11 51.9,21.8 L3.1 | IC6.11 52.5,21.8 v52.4,21.9 | v62.6,25.8 IC6.69
  Bottom 0.152: v63,19 v51.5,19
  Bottom 0.2: v52.4,21.9 52.4,27.9 52.7,28.2 56.6,28.2 57.7,27.1 57.7,26.1 58.3,25.5 62.3,25.5 v62.6,25.8
+1V8A  (via drill 0.3)
  Top 0.2: IC6.7 54.2,23.4 v53.7,23.7 v53.7,28.8 | v51.3,28.8 51.3,23.8 L3.2 | IC6.74 60.6,23.8 v60.3,23.5
  Bottom 0.2: v53.7,28.8 v51.3,28.8 | v60.3,23.5 55,23.5 v53.7,23.7
+3V3  (via drill 0.3)
  Top 0.152: 22,35 22,34.5 RN3.1 | 22,37 22,36 | 22,36 22,35 | 22,35 RN3.2 | 22,36 RN3.3 | v37,50 37,52.5 IC13.5 | v33.5,50 33.5,47.5 R6.1 33.5,47 v33.5,38.5 33.5,28 34,27.5 34,25.5 34.5,25 34.5,22.5 D2.A 34.5,22 34.5,17.5 36,16 36,15 C16.1 36,14.5 36,12.5 35.5,12 v35.5,9 35.5,8 | v22,38.5 22,37 | 22,37 RN3.4 | 35.5,8 35.5,2 37,2 C18.+ | 35.5,8 36,8.5 37,8.5 C13.+ | 44,17 44,14 43.5,13.5 C23.+ v43.5,9.5 | 44,17 44,21 46.5,23.5 L4.2 | 44,17 C24.1 | v49.5,9.5 49.5,12 | v45,9.5 45,6.5 U1.5 | IC6.18 55.5,19 v55,18.5 | 49.5,12 v49.5,18.5 | 49.5,12 C25.1 | 79.5,21 80,20.5 80,20 80.5,20 IC10.5 | 79.5,21 79.5,22 80,22.5 80,24.5 | 80,24.5 80.5,24.5 IC3.5 | v68.5,26.5 68.5,32 R12.2 | v79.5,26 80,25.5 80,24.5 | 80,5 80,10 | 80,10 80,10.5 80.5,10.5 IC11.5 | 80,5 80.5,4.5 81,4.5 C22.1 | 79,12.5 80.5,14 80.5,15.5 IC12.5 | 79,12.5 79,11 80,10 | v67,1 67,4 L2.P$2 67,4.5 67,6 68,7 68,9.5 C17.1 68,10 v68,17.5 | v79.5,1 79.5,4 80,4.5 80,5 | 79.5,21 79,20.5 79,12.5 | v141.5,31.5 141.5,32.5 R19.1 | v146,31.5 146,32.5 R18.1 | v178.5,1.5 178.5,5 X2.4 | v113.5,7 v113.5,1 | v136.5,31.5 136.5,26.5 136,26 136,4 135,3 v135,1
  Top 0.2: IC6.44 69,19.4 69.1,19.3 69.1,17.8 68.8,17.5 v68,17.5 | IC6.18 54.9,19 v54.1,19.8 | v58.4,21.6 57.8,21.6 57.6,21.4 IC6.12
  Bottom 0.152: v33.5,50 v37,50 | v33.5,38.5 v22,38.5 | v45,9.5 v49.5,9.5 | v49.5,18.5 v55,18.5 58.5,18.5 59,18 67.5,18 v68,17.5 | v45,9.5 v43.5,9.5 | v35.5,9 44.5,9 v45,9.5 | v68.5,26.5 69,26 v79.5,26 | v67,1 v79.5,1 v113.5,1 124.5,1 125,1.5 129.5,1.5 130,1 v135,1 172.5,1 173,1.5 v178.5,1.5 | v146,31.5 v141.5,31.5 v136.5,31.5 | v113.5,7 110,7 XB1.1
  Bottom 0.2: v54.1,19.8 54.1,20.1 54.4,20.4 58.1,20.4 58.4,20.7 v58.4,21.6
+3V3A  (via drill 0.3)
  Top 0.152: v31,42.5 C19.+ v31,27 | v76,21.5 76.5,21.5 C21.1 | v75,21.5 75,27.5 75.5,28 77,28 C20.1 | v60.5,14 60.5,10 C1.1 | v47.5,14 47.5,18 46.5,19 L4.1 46.5,22 47.5,23 v47.5,27.5 | v74,14 v74,21.5
  Top 0.2: IC6.2 57.7,25.4 57.8,25.5 57.8,27.9 56.9,28.8 56.9,29.6 58.4,31.1 58.4,36.4 v56.4,38.4 | v51.6,38.3 51.5,38.3 v50.2,37 | v43.3,37 43.3,34.3 v42.5,33.5 | v39.2,33.5 39.2,30.1 40,29.3 42.5,29.3 43.3,28.5 v43.3,28.1
  Bottom 0.152: v31,42.5 16.5,42.5 U$1.R3 | v76,21.5 v75,21.5 v74,21.5 | v47.5,14 v60.5,14 v74,14 | v31,27 40,27 40.5,27.5 43.3,27.5 v47.5,27.5
  Bottom 0.2: v56.4,38.4 51.7,38.4 v51.6,38.3 | v50.2,37 v43.3,37 | v42.5,33.5 v39.2,33.5 | v43.3,28.1 43.3,27.5
+5V  (via drill 0.3)
  Top 0.152: v22,32.5 22,31.5 RN1.4 | v37.5,32.5 37.5,29.5 C8.+ | v12,32.5 12,52 10.5,52 R1.2 | v131.5,30.5 131.5,32.5 C7.1 | v142,30.5 142,20.5 ICSP.2 | v147.5,20.5 147.5,26 U$3.8 | v152.5,20.5 152.5,18 JP4.3 | v76,16 77,16 C6.1 | v74,33 74,26.5 74.5,26 74.5,20 75,19.5 v75,16 74.5,15.5 74.5,4 R5.1 74.5,3.5 v74.5,1.5 | IC1.4 88.1,33.5 91,33.5 v91.2,33 v91.2,30.5
  Top 0.406: 45,3.65 45,2 45.5,1.5 46.5,1.5 46.95,1.95 U1.3 48.8,3.7 49.5,3 49.5,2 50,1.5 v51.5,1.5 52,2 52,3.6 IC5.5 | 45,3.65 U1.1 | 45,3.65 42.35,3.65 41.5,4.5 41.5,8 41,8.5 v41,10 | v33,10 30,10
  Top 0.813: v40.5,26.5 40.5,27.5 40,28 37.75,28 C8.+
  Top 1.676: IC4.2 IC4.4 28.32,5.32 30,7 30,10 30,15.5 v30.5,16
  Bottom 0.152: v37.5,32.5 v22,32.5 v12,32.5 | v142,30.5 v131.5,30.5 v91.2,30.5 | ICSP.2 142.5,20.5 v147.5,20.5 v152.5,20.5 | v76,16 v75,16 | v74,33 v91.2,33 | v74.5,1.5 v51.5,1.5
  Bottom 0.406: v41,10 v33,10
  Bottom 0.813: v30.5,16 39.5,16 40.5,17 v40.5,26.5
A
  Top 0.152: U$3.6 148,29 149,29 149,36 147,38 147,45 145,47 145,48 OUT4.6
  Bottom 0.152: 110.5,49.5 111.5,48.5 OUT2.6 | 110.5,49.5 96,49.5 95,48.5 OUT1.6 | 127,49.5 128,48.5 OUT3.6 | 110.5,49.5 127,49.5 | 143.5,49.5 144.5,48.5 OUT4.6 | 127,49.5 143.5,49.5 | 160,49.5 161,48.5 OUT5.6 | 143.5,49.5 160,49.5 | 160,49.5 176.5,49.5 177.5,48.5 OUT6.6
AD0  (via drill 0.3)
  Top 0.152: v125.5,26 125.5,27.5 U$2.41 | v144,25.5 144,20.5 145,19.5 145,7 146.5,5.5 146.5,3 JP6.1
  Bottom 0.152: v125.5,26 130.5,26 131,25.5 v144,25.5
AD1  (via drill 0.3)
  Top 0.152: v126,25.5 126,27.5 U$2.40 | v143.5,25 143.5,6 144,5.5 144,3 JP6.2
  Bottom 0.152: v126,25.5 130.5,25.5 131,25 v143.5,25
AD2  (via drill 0.3)
  Top 0.152: U$2.39 127,25 127.5,24.5 v127.5,23.5 | v141,23.5 141,6 141.5,5.5 141.5,3 JP6.3
  Bottom 0.152: v141,23.5 v127.5,23.5
AD3  (via drill 0.3)
  Top 0.152: v128,23 128,27.5 U$2.38 | v140.5,23 140.5,15 139,13.5 139,3 JP6.4
  Bottom 0.152: v140.5,23 v128,23
AD4  (via drill 0.3)
  Top 0.152: v128.5,21.5 128.5,27.5 U$2.37 | v138,21 138,15.5 136.5,14 136.5,3 JP6.5
  Bottom 0.152: v128.5,21.5 136,21.5 136.5,21 v138,21
AD5  (via drill 0.3)
  Top 0.152: v129.5,22.5 129.5,27.5 U$2.36 | v137.5,16 v137.5,22.5 | v134,16 134,3 JP6.6
  Bottom 0.152: v137.5,22.5 v129.5,22.5 | v134,16 v137.5,16
B
  Top 0.152: U$3.7 148,27.5 149.5,27.5 149.5,36 147.5,38 147.5,48 OUT4.4
  Bottom 0.152: 112.5,46.5 114,48 OUT2.4 | 112.5,46.5 100,46.5 98.5,48 98,48 OUT1.4 | 129,46.5 130.5,48 OUT3.4 | 112.5,46.5 129,46.5 | 145.5,46.5 147,48 OUT4.4 | 129,46.5 145.5,46.5 | 162,46.5 163.5,48 OUT5.4 | 145.5,46.5 162,46.5 | 162,46.5 178.5,46.5 180,48 OUT6.4
BOOST  (via drill 0.3)
  Top 0.152: D2.C 38,22 38,18.5 C10.1 38,18 38,17.5 39.5,17.5 39.5,17 40,16.5 40,12 40.5,11.5 v40.5,8 | v53,8 53,6 IC5.1
  Bottom 0.152: v53,8 52,8 51.5,8.5 45,8.5 44.5,8 v40.5,8
COLLLED  (via drill 0.3)
  Top 0.2: IC6.71 61.8,30.8 62.8,31.8 62.8,32.9 63.7,33.8 v63.7,36.1 | v61.7,36.1 61.7,38.1 61.1,38.7 61.1,42.6 61.6,43.1 65,43.1 65.9,44 65.9,48.5 v65.6,48.8 | v56.4,51 54.5,51 53.9,51.6 53.9,55.85 100M.C
  Bottom 0.2: v63.7,36.1 v61.7,36.1 | v65.6,48.8 57.4,48.8 57,49.2 57,50.4 v56.4,51
D4  (via drill 0.3)
  Top 0.152: v131.5,11 131.5,17.5 131,18 131,19.5 132.5,19.5 U$2.25 | v152,11 152,2.5 JP7.5
  Bottom 0.152: v152,11 v131.5,11
D5  (via drill 0.3)
  Top 0.152: v134,24 134,24.5 133,24.5 U$2.31 | v151.5,24 151.5,5.5 149.5,3.5 149.5,2.5 JP7.6
  Bottom 0.152: v151.5,24 v134,24
D6  (via drill 0.3)
  Top 0.152: v129,26.5 129,22 130.5,20.5 131.5,20.5 131.5,21 132.5,21 U$2.27 | v138,30 v138,26 | v167,39.5 v167,30
  Bottom 0.152: v129,26.5 130.5,26.5 131,26 v138,26 | v167,30 v138,30 | v167,39.5 170.5,39.5 JP8.1
D7  (via drill 0.3)
  Top 0.152: v121,31.5 121,26 U$2.1 | v166.5,37 v166.5,30.5
  Bottom 0.152: v121,31.5 125,31.5 125.5,31 135,31 136,32 146.5,32 147,31.5 148,31.5 149,30.5 v166.5,30.5 | v166.5,37 170.5,37 JP8.2
D8  (via drill 0.3)
  Top 0.152: U$2.28 134,22 v134,20.5 | v118,28 v118,20.5 | v167.5,34.5 v167.5,28.5
  Bottom 0.152: v134,20.5 132,20.5 131.5,20 128,20 127.5,20.5 v118,20.5 | v118,28 131.5,28 132,28.5 v167.5,28.5 | v167.5,34.5 170.5,34.5 JP8.3
D9  (via drill 0.3)
  Top 0.152: v134.5,21 134.5,23 133,23 U$2.29 | v118.5,28.5 v118.5,21 | v168,32 v168,29
  Bottom 0.152: v134.5,21 132,21 131.5,20.5 128,20.5 127.5,21 v118.5,21 | v118.5,28.5 131.5,28.5 132,29 v168,29 | v168,32 170.5,32 JP8.4
D10  (via drill 0.3)
  Top 0.152: v131,21 131,23.5 132.5,23.5 U$2.30 | v119,29 v119,21.5
  Bottom 0.152: v131,21 128,21 127.5,21.5 v119,21.5 | v119,29 131.5,29 132,29.5 170.5,29.5 JP8.5
D11  (via drill 0.3)
  Top 0.152: v123,14.5 U$2.12 | v154.5,26 v154.5,14
  Bottom 0.152: v123,14.5 124.5,14.5 125,15 138,15 139,14 v154.5,14 | v154.5,26 167,26 168,27 170.5,27 JP8.6
D12  (via drill 0.3)
  Top 0.152: v139,27 v139,26 | v117.5,20 v117.5,27.5 | v127,20 131.5,20 132,20.5 132.5,20.5 U$2.26
  Bottom 0.152: v139,26 144.5,26 145.5,25 167,25 167.5,24.5 170.5,24.5 JP9.1 | v139,27 131,27 130.5,27.5 v117.5,27.5 | v127,20 v117.5,20
D13  (via drill 0.3)
  Top 0.152: v199,36.5 199,37.5 LED13.A | v180,21.5 v180,36.5 | v131,24 131,25 132.5,25 U$2.32 | v127,24 127,24.5 126.5,25 v126.5,26.5 | v167,21.5 v167,25.5
  Bottom 0.152: v180,36.5 v199,36.5 | v180,21.5 171,21.5 JP9.2 170.5,21.5 v167,21.5 | v127,24 v131,24 | v126.5,26.5 128,26.5 128.5,27 130.5,27 131,26.5 144.5,26.5 145.5,25.5 v167,25.5
EN  (via drill 0.3)
  Top 0.152: v51,2.5 51,3.5 IC5.4 | v72.5,2 72.5,3.5 R5.2
  Bottom 0.152: v51,2.5 51.5,2 v72.5,2
FB  (via drill 0.3)
  Top 0.152: v50,31.5 50,13 50.5,12.5 50.5,11.5 51,11 51,6 IC5.3 | v34,31.5 34,45 35,46 35,47 R6.2 35.5,47 v36,46.5 | v56,47 56,46.5 57,46.5 R7.1
  Bottom 0.152: v34,31.5 v50,31.5 | v56,47 43.5,47 43,46.5 v36,46.5
FDXLED  (via drill 0.3)
  Top 0.2: IC6.70 62.2,29.9 v62.7,30.4 | v65.2,30.4 65.3,30.4 65.6,30.7 v65.6,33 | v73,42.3 v73,56.4 | v62.4,57 61.1,57 60,58.1 56.55,58.1 FULLD.C
  Bottom 0.2: v62.7,30.4 v65.2,30.4 | v65.6,33 67,33 68.3,34.3 68.3,36.2 73,40.9 v73,42.3 | v73,56.4 72.3,57 v62.4,57
GND  (via drill 0.3)
  Top 0.152: C15.2 136,32.5 v136,31 136,26.5 135.5,26 U$2.33 130.5,26 130,26.5 | v147.5,31 147.5,30 U$3.5 | 130,26.5 130,27.5 U$2.35 130,28 130,32.5 C7.2 129.5,33 v129.5,46 | v147.5,15.5 147.5,17.5 JP4.1 | v125.5,1 v125.5,2 125.5,3 C14.1 125,3.5 124.5,4 124.5,10 125.5,11 125.5,16 U$2.15 125.5,16.5 v125.5,18.5 125.5,22 124.5,23 | v129,1 129,3 C5.1 | C3.2 123,32.5 123,31.5 124,30.5 124,28 U$2.43 124,27.5 124,26.5 124.5,26 v124.5,25 124.5,23 | 124.5,23 121.5,23 U$2.5 | v131.5,18.5 131.5,18 U$2.23 133,18 v133,16.5 | v130,25 130,26.5 | 176.5,15 176.5,5.5 X2.6 176.5,5 v176.5,1 | 176.5,15 175.5,16 X2.GND4 | 176.5,15 176.5,15.5 180.5,15.5 X2.GND3 181,16 v181,27.5 | v173.5,1 173.5,2 X2.GND2 | v185.5,1 186.5,1 X2.GND1 | X3.GND 192,27.5 v190,27.5 190,37.5 R17.1 190,38 190,42 R15.1 190,42.5 190,45 R16.1 190,45.5 v190,48 | v100,46 100,48 OUT1.2 | v117,46 117,48 OUT2.2 | v133.5,46 133.5,48 OUT3.2 | v150,46 150,48 OUT4.2 | v166.5,46 166.5,48 OUT5.2 | 83,25 82.5,24.5 IC3.1 | 83,25 83,26 82.5,26 IC3.3 82,26 81.5,26.5 78.5,26.5 78.5,27 | 75.5,19.5 75.5,14 77,14 C6.2 | 75.5,19.5 76,20 76.5,20 C21.2 | 75.5,19.5 v75.5,21 75.5,26.5 77,26.5 C20.2 77.5,26 78.5,27 | 78.5,27 v78.5,33.5 77.5,33.5 C4.1 | v85.4,33.5 85.6,33.5 85.8,33.3 IC1.1 | v98,6.5 95.5,6.5 R14.1 95,6.5 v95,5.5 | v102.5,6.5 104,6.5 R10.1 104.5,6.5 v104.5,1.5 | 82.5,7 82.5,10.5 | 82.5,7 81.5,6 C22.2 | 82.5,16.5 82.5,20 IC10.1 | 82.5,15 82.5,15.5 IC12.1 | 82.5,15 82.5,11.5 IC11.3 | 82.5,16.5 83,16.5 83,16 | 83,16 83,15.5 82.5,15 | 82.5,16.5 IC12.3 | 82.5,10.5 83.5,10.5 83.5,15.5 83,16 | 82.5,10.5 IC11.1 | v83,5.5 83,6 82.5,6.5 82.5,7 | 83,25 83.5,24.5 83.5,16.5 83,16 | v44,57 ON.C v44,46.5
  Top 0.152: IC13.3 35.5,55.5 v35.5,57 v35.5,59 | 20.5,54.5 20.5,52.5 | 20.5,54.5 20,55 S1.P$2 | 20.5,52.5 19.5,52.5 v19.5,47 | 20.5,52.5 C2.1 | v21,59 21,55.5 20.5,55 20.5,54.5 | 22,29.5 21,29.5 RN1.8 20.5,29.5 16.5,29.5 16.5,28.5 C11.- | 22,29.5 22,30 | 22,30 22,31 RN1.3 | 22,30 RN1.2 | 22,29.5 27,29.5 | 27,29.5 C19.- v28,27.5 | 22,29.5 RN1.1 | v34.5,27.5 34.5,29 C8.- | 27,29.5 27,17 25.5,15.5 | 38,12 38,11.5 37.5,11 C13.- 38,12 | 38,12 38,14.5 C16.2 | 39,11 v39,8.5 39,5 37.5,5 C18.- | 38,12 39,11 | 51.5,9.5 52,9 52,6 IC5.2 | 51.5,9.5 51.5,12 C25.2 | C24.2 46,17 46,14 46.5,13.5 C23.- v46.5,9 46.5,7.5 46,7 U1.2 | v51.5,9 51.5,9.5 | C9.2 51.5,41.5 51.5,46 v52,46.5 53.5,46.5 R11.1 54,46.5 55.5,46.5 55.5,46 57,44.5 R7.2 57.5,45 v60,45 60.5,45 60.5,47 R2.2 | v67.5,45 67.5,41.5 | D3.P$2 57,6 58.5,6 v58.5,8.5 58.5,9.5 C1.2 58.5,10 58.5,16 IC6.22 58.5,16.5 59,16.5 | 59,16.5 59.5,16.5 IC6.24 | 59.5,21 59.5,19.4 v59.5,18.5 59.5,17.5 59,17 59,16.5 | 59,16.5 IC6.23 | 65.5,16.5 66,16 66,10 C17.2 | IC6.68 63,28.5 63.7,29.2 64,29.5 64.5,29.5 | 64.5,29.5 64.5,28 IC6.64 64.5,27.5 65,27.5 | 67,21 67.5,20.5 IC6.47 | 67,21 67,22 67.5,22 | 67.5,22.5 67.5,22 | 68.5,21.5 68,21 IC6.48 67,21 | 68.5,21.5 68.5,22 68,22 68,22.5 IC6.52 67.5,22.5 | 67.5,22 67.5,21.5 IC6.49 | 67.5,22.5 67.5,23 IC6.53 | 67.5,19 67.5,18.5 IC6.42 | 64.5,16.5 63.5,16.5 IC6.34 | 64.5,16.5 65,16.5 | 64.5,16.5 IC6.37 | 66,19 65,19 v65,18.5 65,16.5 | 66,19 67.5,19 | 67.5,19 IC6.43 | 66,21 67,21 | 66,19 66,21 | 65,27.5 65,26 64.5,25.5 64.5,22 65,21.5 66,21.5 66,21 | 65,27.5 IC6.63 | 65,16.5 65.5,16.5 | 65.5,16.5 IC6.39 | 65,16.5 IC6.38 | 67.5,41.5 64.5,41.5 64.5,29.5 | 67.5,41.5 C12.2 | 39,11 v39,15 | v26,15 25.66,15.34
  Top 0.152: v69,21 68.5,21 68.5,21.5
  Top 0.2: IC6.21 IC6.22 | 59.5,16.5 59.7,16.5 IC6.25 IC6.26 | IC6.54 IC6.53 | IC6.51 IC6.50 67.5,21.9 67.5,22 | 67.5,20.5 67.5,20.3 IC6.46 IC6.45 | 67.5,18.5 67.5,18.3 IC6.41 | 65.5,16.5 65.7,16.5 IC6.40 | 64.5,16.5 64.3,16.5 IC6.36 | 63.5,16.5 63.7,16.5 IC6.35 | IC6.34 63.4,15 63.3,14.9 62.7,14.9 62.6,15 IC6.32 | IC6.77 59.4,29.4 v59.6,29.6 | v63.3,29.6 63.7,29.2 | IC6.20 IC6.19 57.6,18.6 57.7,18.7 57.7,19.3 57.6,19.4 IC6.17 59.5,19.4 | IC6.14 IC6.13 59.5,21 59.5,22.3 59.4,22.4 57.7,22.4 57.6,22.3 57.5,22.3 57.4,22.2 IC6.10 57.7,22.2 58,22.5 58,24.5 57.9,24.6 IC6.4 | IC6.65 IC6.64 | IC10.3 81.52,21.22 81.4,21.1 81.4,20.2 81.6,20 82.12,20 IC10.1
  Top 1.676: X1.3 4.69,14.31 5,14 7.38,14 X1.1 14.3,14.3 15.5,15.5 20.5,15.5 21,16 | 21,16 21,18.82 D1.A | IC4.1 25.66,15.34 25.5,15.5 25,16 21,16
  Bottom 0.152: v136,31 v147.5,31 | v147.5,15.5 142.5,15.5 ICSP.6 142,15.5 141,15.5 140,16.5 v133,16.5 | v129,1 v125.5,1 | v125.5,18.5 v131.5,18.5 | XB1.10 110,25 v124.5,25 v130,25 | v173.5,1 v176.5,1 v185.5,1 | v190,48 183,48 OUT6.2 182.5,48 181,46.5 179,46.5 178.5,46 v166.5,46 v150,46 v133.5,46 v129.5,46 v117,46 v100,46 | v190,27.5 v181,27.5 | v78.5,33.5 v85.4,33.5 | v102.5,6.5 v98,6.5 | v83,5.5 v95,5.5 | v44,57 v35.5,57 | v19.5,47 11,47 U$1.CH1 | v21,59 v35.5,59 | v28,27.5 v34.5,27.5 | v39,8.5 44.5,8.5 45,9 v46.5,9 v51.5,9 52,8.5 v58.5,8.5 | v60,45 v67.5,45 | v65,18.5 v59.5,18.5 | v39,15 v26,15 | v52,46.5 v44,46.5 | v69,21 v75.5,21 | v125.5,2 125,2 124.5,1.5 v104.5,1.5
  Bottom 0.2: v59.6,29.6 v63.3,29.6
  pour Top (isolate 0.254, no thermals): 0,0 199,0 200,1 200,59 199,60 4,60 0,56
  pour Bottom (isolate 0.254, no thermals): 4,60 0,56 0,1 1,0 199,0 200,1 200,59 199,60
LINKLED  (via drill 0.3)
  Top 0.2: U$1.L4 2.67,47.87 3.8,49 v7.1,49 | v66.3,36 66.3,29.3 66.7,28.9 66.7,26.6 v65.9,25.8 | v63.8,25.9 IC6.66
  Bottom 0.2: v7.1,49 29.7,49 31.7,47 31.7,44.1 33.1,42.7 49,42.7 50.4,41.3 50.4,38 51,37.4 64.9,37.4 v66.3,36 | v65.9,25.8 63.9,25.8 v63.8,25.9
MISO  (via drill 0.3)
  Top 0.152: v175.5,11.5 175.5,5.5 X2.7 | U$2.11 122.5,18 v122.5,18.5 | v168.5,13.5 v168.5,11.5 | v144.5,19 v144.5,13.5
  Top 0.2: IC6.27 60.6,15.1 60.2,14.7 59.6,14.7 59.3,14.4 59.3,11.5 v59.5,11.3 | v71,11.3 71,24.1 v72,25.1 | v113.2,27.4 113.2,13.7 v113.5,13.4 | v120.8,13.5 121.2,13.9 U$2.11
  Bottom 0.152: v175.5,11.5 171,11.5 JP9.6 170.5,11.5 v168.5,11.5 | v122.5,18.5 123,19 135,19 136.5,20.5 139,20.5 ICSP.1 139.5,20 140.5,19 v144.5,19 | v144.5,13.5 v168.5,13.5
  Bottom 0.2: v59.5,11.3 v71,11.3 | v72,25.1 81.5,25.1 82.2,25.8 82.2,27.6 82.7,28.1 103.5,28.1 103.9,27.7 112.9,27.7 v113.2,27.4 | v113.5,13.4 120.7,13.4 v120.8,13.5
MOSI  (via drill 0.3)
  Top 0.152: v83,20.5 82.5,20.5 IC10.2 | IC6.28 v61,20.5 | v137,19 v137,17.5 | U$2.10 121,19 120,19 v120,17.5 v120,2.5 | v144,18 v144,13 | v84,20.5 84,10.5 84.5,10 v84.5,2.5
  Bottom 0.152: v61,20.5 v83,20.5 v84,20.5 | v137,17.5 v120,17.5 | v137,19 140,19 141,18 142,18 ICSP.4 142.5,18 v144,18 | v144,13 170,13 170.5,13.5 JP9.5 | v84.5,2.5 103.5,2.5 104,3 109.5,3 110,2.5 v120,2.5
MOSI3  (via drill 0.3)
  Top 0.2: IC10.4 80.5,22.1 v80.8,22.4 | v85,26.5 85,27.2 85.9,28.1 101.2,28.1 102.1,27.2 102.1,26.3 v102.4,26 | v112.2,26.4 112.2,15.2 111.8,14.8 111.8,10.1 112.6,9.3 117.4,9.3 118.2,8.5 118.2,6.9 v118.6,6.5 | v179.9,3.4 179.9,5.18 X2.3
  Bottom 0.2: v80.8,22.4 84.8,22.4 85,22.6 v85,26.5 | v102.4,26 107.7,26 108.5,26.8 111.8,26.8 v112.2,26.4 | v118.6,6.5 124.6,6.5 125.2,7.1 169.2,7.1 172.9,3.4 v179.9,3.4
N$1  (via drill 0.3)
  Top 0.152: v81.5,24 81.5,25 81,25.5 81,26 IC3.4 | v74,24 74,24.7 72.3,26.5 72.3,41.6 70.7,43.2 v70.7,59 | v52.5,59 51.5,59 L.A
  Bottom 0.152: v74,24 v81.5,24 | v52.5,59 v70.7,59
N$2  (via drill 0.3)
  Top 0.152: v18.5,43.5 18.5,37 20.5,37 RN3.5
  Bottom 0.152: v18.5,43.5 15,43.5 14,42.5 7.5,42.5 7,43 4.5,43 U$1.L3
N$3  (via drill 0.3)
  Top 0.152: v19,31.5 19,36 20.5,36 RN3.6 | v4,30 4,33 U$1.L1
  Bottom 0.152: v19,31.5 12.5,31.5 11,30 v4,30
N$5  (via drill 0.3)
  Top 0.152: 20.5,31 20.5,30 RN1.7 | v19.5,31 20.5,31 | v49.5,31 49.5,54.5 51,56 51.5,56 L.C | 20.5,31 RN1.6
  Bottom 0.152: v19.5,31 20,31.5 33,31.5 33.5,31 v49.5,31
N$6  (via drill 0.3)
  Top 0.152: 127,7.5 127,10 126,11 126,16 U$2.16 | 127,7.5 126.5,7 126,7 Y1.1 | v131,5 131,3.5 C5.2 | v126.5,5 126.5,6.5 127,7 127,7.5
  Bottom 0.152: v126.5,5 v131,5
N$7
  Top 0.152: U$2.17 127,10.5 127.5,10 127.5,9.5 | 127.5,9.5 127.5,7 127,6.5 127,3.5 C14.2 | 127.5,9.5 129,9.5 Y1.3
N$8  (via drill 0.3)
  Top 0.152: v20.5,33.5 20.5,31.5 RN1.5 | v31.5,57.5 v31.5,33.5 | v42.5,57.5 43,58 44,58 ON.A
  Bottom 0.152: v31.5,33.5 v20.5,33.5 | v42.5,57.5 v31.5,57.5
N$9  (via drill 0.3)
  Top 0.152: v23,34 22.5,33.5 22,33.5 21,34.5 RN3.8 | v32,58.5 v32,34 | v48,59 49,59 TX.A
  Bottom 0.152: v32,34 v23,34 | v32,58.5 36,58.5 36.5,59 v48,59
N$10
  Top 0.152: 22,42 22,41.5 RN2.3 | 22,42 22,50 21,51 C2.2 | 22,42 RN2.4
N$11  (via drill 0.3)
  Top 0.152: v181,46 181,29.5 182,28.5 182,24 184,22 R8.2 | v116.5,24 v116.5,44 | v122.5,24 122,24.5 121.5,24.5 U$2.3
  Bottom 0.152: v181,46 179,46 178.5,45.5 151.5,45.5 151,45 145,45 144.5,44.5 118.5,44.5 118,44 v116.5,44 | v122.5,24 v116.5,24
N$12  (via drill 0.3)
  Top 0.152: v121.5,32.5 121.5,29 122.5,28 122.5,25 123,24.5 123,23.5 121.5,23.5 U$2.4 | v134,27.5 v134,32 | v168.5,25.5 v168.5,27.5 | v183,25.5 184,25.5 184,25 R9.2
  Bottom 0.152: v121.5,32.5 125,32.5 125.5,32 v134,32 | v168.5,27.5 v134,27.5 | v183,25.5 v168.5,25.5
N$13
  Top 0.254: X3.D- 187.81,25.31 187.5,25 187.5,22.5 187,22 R8.1
N$14
  Top 0.254: X3.D+ 186.61,26.11 186,25.5 186,25.1 R9.1
N$15
  Top 0.406: X3.VBUS 189,24.5 188.5,24 188.5,19.5 188,19 185.94,19 F1.1
N$16  (via drill 0.3)
  Top 0.152: v192,41 192,42 R15.2 | v195.5,41 196.5,42 TXLED.C
  Bottom 0.152: v195.5,41 v192,41
N$17  (via drill 0.3)
  Top 0.152: v106.5,9 106.5,10.5 R13.2
  Bottom 0.152: v106.5,9 109.5,9 XB1.2
N$18  (via drill 0.3)
  Top 0.152: v137,22 137,26 137.5,26.5 137.5,32.5 C15.1 | U$2.6 v122.5,22
  Bottom 0.152: v122.5,22 v137,22
N$19  (via drill 0.3)
  Top 0.152: v123,30 U$2.44 v123,25.5 | U$2.34 v131,30 | v193.5,12.5 193.5,16.5 JP1.2 | v135.5,12.5 135.5,18.5 135,19 134,19 | 134,19 133,19 U$2.24 | v124.5,19.5 124.5,16.5 U$2.14 | 134,19 v134,19.5 | v125,25.5 125,23 126,22 v126,19.5
  Bottom 0.152: v131,30 v123,30 | v135.5,12.5 v193.5,12.5 | v134,19.5 v126,19.5 v124.5,19.5 | v125,25.5 v123,25.5
N$20
  Top 0.152: R10.2 104.5,8.5 107.5,8.5 107.5,4.5 108,4 110,4 WIRELESS_ON.C
N$21
  Top 0.152: U$3.3 153,28.5 153,27.5 U$3.2 152.5,27.5 150.5,27.5 150.5,21 150,20.5 150,18 JP4.2
N$22  (via drill 0.3)
  Top 0.152: v19.5,33 19.5,35.5 20,35.5 20.5,35 RN3.7 | v48,32.5 48.5,33 48.5,54.5 48,55 48,56.5 46.5,58 RX.A
  Bottom 0.152: v19.5,33 38,33 38.5,32.5 v48,32.5
N$23  (via drill 0.3)
  Top 0.152: v109,2.5 109,2 110,2 WIRELESS_ON.A | v85,2 85,11.5 85.5,12 v85.5,21
  Bottom 0.152: v109,2.5 104,2.5 103.5,2 v85,2 | v85.5,21 87.5,21 XB1.13
N$24  (via drill 0.3)
  Top 0.152: v86,17 86,2 87,2 ASSOC.A
  Bottom 0.152: v86,17 87.5,17 XB1.15
N$25  (via drill 0.3)
  Top 0.152: v87.5,5 87.5,4 ASSOC.C | v93.5,5 93.5,8 94,8.5 95,8.5 R14.2
  Bottom 0.152: v93.5,5 v87.5,5
N$26  (via drill 0.3)
  Top 0.152: v56.5,57 FULLD.A | v69,44.5 v69,58 | v146.5,43.5 146.5,38 148,36.5 148,33 R18.2
  Bottom 0.152: v56.5,57 57.5,58 v69,58 | v69,44.5 114.5,44.5 116,43 118,43 118.5,43.5 v146.5,43.5
N$29  (via drill 0.3)
  Top 0.152: 22,39.5 22,40.5 RN2.2 | 22,39.5 22.5,39 v22.5,38 | v32.5,30 v32.5,38 | v75.5,31.5 77,31.5 C4.2 | 22,39.5 RN2.1
  Bottom 0.152: v32.5,38 v22.5,38 | v32.5,30 53.5,30 55,31.5 v75.5,31.5
N$30  (via drill 0.3)
  Top 0.152: v40.5,45.5 40.5,47 R3.2 | v62.5,45.5 62.5,47 R2.1
  Bottom 0.152: v62.5,45.5 v40.5,45.5
N$31  (via drill 0.3)
  Top 0.2: IC6.1 56.4,29.8 57.8,31.2 57.8,35.7 v57.2,36.3 | v60.1,36.6 60.1,42.6 59.5,43.2 55.6,43.2 v55.3,43.5 | v46.8,44.3 46.8,48.4 46.5,48.7 v45.8,48.7 | v42.6,48.7 42.4,48.5 42.4,47.35 R3.1
  Bottom 0.2: v57.2,36.3 57.2,36.4 57.4,36.6 v60.1,36.6 | v55.3,43.5 47.6,43.5 v46.8,44.3 | v45.8,48.7 v42.6,48.7
N$36
  Top 0.152: IC6.58 70,25 70.5,25.5 70.5,32 R12.1
  Top 0.2: IC6.58 IC6.57 68.9,24.6 69.1,24.4 69.1,23.9 69,23.8 IC6.55
N$37
  Top 0.152: R16.2 192,45.5 196.5,45.5 RXLED.C
N$38
  Top 0.152: R17.2 192,37.5 196.5,37.5 LED13.C
N$39  (via drill 0.3)
  Top 0.152: v54,57 100M.A | v69.9,45 v69.9,58.5 | v142.5,44 142.5,36 143,35.5 143,33 R19.2
  Bottom 0.152: v54,57 55.5,58.5 v69.9,58.5 | v69.9,45 114.5,45 116,43.5 118,43.5 118.5,44 v142.5,44
N$40  (via drill 0.3)
  other vias: 14.5,7.5
N$41  (via drill 0.3)
  other vias: 14.5,6
N$42  (via drill 0.3)
  other vias: 14.5,4.5
N$43  (via drill 0.3)
  other vias: 14.5,3
N$44  (via drill 0.3)
  other vias: 14.5,1.5
N$45  (via drill 0.3)
  other vias: 32.5,7.5
N$46  (via drill 0.3)
  other vias: 32.5,6
N$47  (via drill 0.3)
  other vias: 32.5,4.5
N$48  (via drill 0.3)
  other vias: 32.5,3
N$49  (via drill 0.3)
  other vias: 32.5,1.5
OSC1E  (via drill 0.3)
  Top 0.152: 54,39 54,32.5 R4.1 | 54,39 53.5,39.5 C9.1 | v54.5,40.5 54.5,40 54,39.5 54,39
  Top 0.2: IC6.76 59.8,26.3 59.5,26 59.1,26 v59,26.1 | v58.7,30 58.7,30.5 59.1,30.9 59.1,37.8 57.8,39.1 57.8,40.26 Q1.2
  Bottom 0.152: v54.5,40.5 57.5,40.5 Q1.2
  Bottom 0.2: v59,26.1 59,27.9 58.6,28.3 58.6,29.9 v58.7,30
OSC2E  (via drill 0.3)
  Top 0.152: v52.5,35 52.5,32.5 R4.2 | v63,35 63,40 Q1.1 | v67.5,40.5 67.5,40 C12.1
  Top 0.2: IC6.75 60.2,29.2 60.4,29.4 60.4,31 59.8,31.6 59.8,33.9 60.1,34.2 62.2,34.2 v63,35
  Bottom 0.152: v63,35 v52.5,35 | v67.5,40.5 63,40.5 Q1.1
RESET  (via drill 0.3)
  Top 0.152: v124,15 124,16 U$2.13 | v11.5,50.5 10.5,50.5 R1.1 | S1.P$1 12.5,55 v12.5,50.5 v12.5,32 | v90.5,31 v90.5,32.5 89.9,32.5 88.8,30.6 IC1.3 | C3.1 124.5,32.5 v124.5,31 v124.5,29.5 | v136.5,15.5 136.5,26 137,26.5 v137,30
  Bottom 0.152: v124,15 124.5,15.5 v136.5,15.5 139,15.5 ICSP.5 | v12.5,50.5 v11.5,50.5 | v90.5,31 v124.5,31 | v12.5,32 73.5,32 74,32.5 v90.5,32.5 | v137,30 132,30 131.5,29.5 v124.5,29.5
RESET_W  (via drill 0.3)
  Top 0.2: IC1.2 86.13,30.23 85.9,30.1 v82.2,30.1 | v69.5,29.9 69.5,25.7 69.3,25.5 68.8,25.5 68.7,25.4 IC6.59
  Bottom 0.2: v82.2,30.1 69.7,30.1 v69.5,29.9
RX  (via drill 0.3)
  Top 0.152: v129.5,11.5 129.5,16 U$2.20 | v162,11.5 162,2.5 JP7.1 | v151,11.5 v151,26 152.5,26 U$3.1 | v150,26 150,27.5 150.5,28 150.5,37.5 JP5.1
  Bottom 0.152: v162,11.5 v151,11.5 v129.5,11.5 | v151,26 v150,26
RXI  (via drill 0.3)
  Top 0.152: v117,45 v117,11 | v144,45.5 144,40.5 JP2.2
  Bottom 0.152: v117,11 110,11 XB1.3 | v117,45 117,45.5 v144,45.5
RXIN  (via drill 0.3)
  Top 0.152: v19.5,44 19.5,40.5 20.5,40.5 RN2.7
  Top 0.2: IC6.6 55.3,23.8 54.5,24.6 54.5,26.9 55.3,27.7 55.3,30.3 56.5,31.5 56.5,33.2 v56.3,33.4 | v25.3,35.5 25.3,44.5 v24.3,45.5
  Bottom 0.152: v19.5,44 14,44 U$1.R2
  Bottom 0.2: v56.3,33.4 49.5,33.4 48.3,34.6 34.2,34.6 33.4,35.4 25.4,35.4 v25.3,35.5 | v24.3,45.5 20.3,45.5 19.7,44.9 19.7,44.2 v19.5,44
RXIP  (via drill 0.3)
  Top 0.152: v19,45 19,39.5 20.5,39.5 RN2.8
  Top 0.2: IC6.5 55.5,24.2 55,24.7 55,26.6 55.8,27.4 55.8,29.9 57.3,31.4 57.3,34 v57,34.3 | v37,35.6 37,39.6 v36.5,40.1 | v27,40.1 27,45.9 v26.2,46.7
  Bottom 0.152: v19,45 16.5,45 U$1.R1
  Bottom 0.2: v57,34.3 49.6,34.3 48.6,35.3 37.3,35.3 v37,35.6 | v36.5,40.1 v27,40.1 | v26.2,46.7 20.4,46.7 19.3,45.6 19.3,45.3 v19,45
RXLED  (via drill 0.3)
  Top 0.2: IC6.72 61.4,31.3 62.1,32 62.1,33.3 v62.8,34 | v64.7,44.1 64.7,53.1 v64.3,53.5 | v46.5,54.4 RX.C
  Bottom 0.2: v62.8,34 66.6,34 67.2,34.6 67.2,36.3 65.2,38.3 61.6,38.3 61.2,38.7 61.2,43 61.8,43.6 64.2,43.6 v64.7,44.1 | v64.3,53.5 47.4,53.5 v46.5,54.4
SCK  (via drill 0.3)
  Top 0.152: v83,11 82.5,11 IC11.2 | v85.5,1.5 v85.5,11 | v119.5,2 v119.5,18 119.5,19 120,19.5 121,19.5 U$2.9
  Top 0.2: IC11.2 81.35,10.95 81.3,11 81.3,12.4 v81,12.7 | v61.8,12.8 IC6.30
  Bottom 0.152: v85.5,11 v83,11 | v85.5,1.5 103.5,1.5 104,2 v119.5,2 | v119.5,18 139,18 ICSP.3 139.5,17.5 140.5,16.5 142.5,16.5 143,16 170.5,16 JP9.4
  Bottom 0.2: v81,12.7 61.9,12.7 v61.8,12.8
SCK3  (via drill 0.3)
  Top 0.152: v80.5,11 80.5,11.5 IC11.4 | v83.5,10 84,10 v84,3 | v124,9 v124,3 | v177.5,9 177.5,5.5 X2.5
  Bottom 0.152: v80.5,11 81.5,10 v83.5,10 | v84,3 103.5,3 104,3.5 109.5,3.5 110,3 v124,3 | v177.5,9 v124,9
SCL  (via drill 0.3)
  Top 0.152: v128,10.5 128,16 U$2.18 | v154.5,10.5 154.5,2.5 JP7.4
  Bottom 0.152: v154.5,10.5 v128,10.5
SDA  (via drill 0.3)
  Top 0.152: v128.5,11 128.5,16 U$2.19 | v157,10 157,2.5 JP7.3
  Bottom 0.152: v128.5,11 127.5,11 127.5,10 v157,10
SEN  (via drill 0.3)
  Top 0.2: IC6.31 62.2,14.1 62.4,13.9 64.3,13.9 v65.1,14.7 | v70.1,18.7 70.1,24.2 71.8,25.9 71.8,40.7 68.2,43.7 68.2,52.1 v66.4,52.1 | v34.1,52.6 35.26,52.6 IC13.4
  Bottom 0.2: v65.1,14.7 69.8,14.7 70.1,15 v70.1,18.7 | v66.4,52.1 40.4,52.1 38.5,54 34.3,54 33.9,53.6 33.9,52.8 v34.1,52.6
SEN3  (via drill 0.3)
  Top 0.152: v80.5,16 80.5,16.5 IC12.4 | v78.5,15.5 78.5,4.5 79,4 v79,3.5 | v123.5,8.5 v123.5,3.5 | v181,8.5 181,6 X2.2
  Bottom 0.152: v80.5,16 80,15.5 v78.5,15.5 | v79,3.5 103.5,3.5 104,4 109.5,4 110,3.5 v123.5,3.5 | v181,8.5 v123.5,8.5
SPDLED  (via drill 0.3)
  Top 0.2: IC6.67 63.4,26.5 63.2,26.3 63.2,25 v62.5,24.3 | v54.4,27.7 54.4,30.2 55.4,31.2 55.4,36.2 v55.3,36.3 | v18.2,36 18.2,32.4 17.5,31.7 17.5,30.9 16.7,30.1 12.3,30.1 11.3,29.1 5.7,29.1 4.8,28.2 3.3,28.2 1.9,29.6 1.9,34.8 U$1.L2
  Bottom 0.2: v62.5,24.3 57.5,24.3 57,24.8 57,27.2 56.5,27.7 v54.4,27.7 | v55.3,36.3 18.5,36.3 v18.2,36
SS  (via drill 0.3)
  Top 0.152: v36.5,46 36.5,55 IC13.2 | v52.5,46 52.5,45.5 53,45 53.5,45 R11.2 | v199,43 199,45 RXLED.A | v180.5,19 v180.5,43 | v119.5,24.5 119.5,21.5 120,21 120,20.5 121,20.5 U$2.8 | v155.5,19 v155.5,24.5 | v116,24.5 v116,45.5
  Top 0.2: IC6.29 61.4,15 61.1,14.7 61.1,12.2 61.3,12 62.4,12 62.9,11.5 62.9,10 v62.5,9.6 | v55.5,12.4 55.5,16.3 55.2,16.6 v51.4,16.6 | v49.1,27.4 49.1,29.4 45.8,32.7 45.8,43.4 44.8,44.4 38.6,44.4 v38.4,44.6
  Bottom 0.152: v36.5,46 38.5,46 v52.5,46 63,46 63.5,45.5 v116,45.5 | v180.5,43 v199,43 | v180.5,19 171,19 JP9.3 170.5,19 v155.5,19 | v155.5,24.5 v119.5,24.5 v116,24.5
  Bottom 0.2: v62.5,9.6 55.8,9.6 55.5,9.9 v55.5,12.4 | v51.4,16.6 48.7,16.6 48.3,17 48.3,25.7 49.1,26.5 v49.1,27.4 | v38.4,44.6 38.4,45.9 38.5,46
SUB_PW  (via drill 0.3)
  Top 1.676: IC4.3 18.49,11.51 v18,12
  Bottom 1.676: v18,12 18,18.5 18.5,19 27,19 28,20 28,23.06 JP3.2
SW  (via drill 0.3)
  Top 0.152: v53,1 53,3.5 IC5.6 | v56.5,1 56.5,3 D3.P$1 | v36,17 36,18 C10.2 | v39,17 39.5,16.5 v39.5,1 | v61,1 61,4 L2.P$1
  Bottom 0.152: v39,17 v36,17 | v39.5,1 v53,1 v56.5,1 v61,1
TX  (via drill 0.3)
  Top 0.152: v152.5,36.5 152.5,30 U$3.4 153,30 155,30 v155,12 | v130,12 130,16 U$2.21 | v159.5,12 159.5,2.5 JP7.2
  Bottom 0.152: v152.5,36.5 148.5,36.5 147,38 144.5,38 JP2.1 | v159.5,12 v155,12 v130,12
TXA  (via drill 0.3)
  Top 0.152: v198.5,43.5 198.5,42 TXLED.A | v155.5,45 155.5,25.5 156,25 156,18.5 155.5,18 v155.5,9.5 | U$2.22 v131,9.5
  Bottom 0.152: v198.5,43.5 180,43.5 178.5,45 v155.5,45 | v131,9.5 v155.5,9.5
TXLED  (via drill 0.3)
  Top 0.152: v49,32.5 TX.C | IC6.73 v61,32.5
  Bottom 0.152: v61,32.5 v49,32.5
TXO  (via drill 0.3)
  Top 0.152: v104.5,30 104.5,11 R13.1 | v117.5,44.5 v117.5,30 | v150.5,45.5 150.5,40.5 JP5.2
  Bottom 0.152: v117.5,30 v104.5,30 | v117.5,44.5 117.5,45 144.5,45 145,45.5 v150.5,45.5
TXON  (via drill 0.3)
  Top 0.152: v20,42 20.5,42 RN2.5
  Top 0.2: IC6.9 53.7,22.6 53.5,22.4 52.8,22.4 52.7,22.5 v50.5,22.5 | v49.2,22.5 48.6,22.5 48.3,22.8 48.3,29.3 48.1,29.5 44.1,29.5 40.5,33.1 40.5,40.1 39.7,40.9 v36.8,40.9 | v23.8,41.5 23.8,44 23.6,44.2 v23.4,44.2 | v20.6,44.1 20.6,42.3 RN2.5
  Bottom 0.152: v20,42 17.5,42 17,41.5 14,41.5 U$1.R4
  Bottom 0.2: v50.5,22.5 v49.2,22.5 | v36.8,40.9 24.4,40.9 v23.8,41.5 | v23.4,44.2 20.7,44.2 v20.6,44.1
TXOP  (via drill 0.3)
  Top 0.152: v20,41 20.5,41.5 RN2.6 | IC6.8 53,23 v53,30.5 | v33,39 v33,30.5
  Bottom 0.152: 19,40 v20,41 | 19,40 16.5,40 U$1.R5 | v33,30.5 v53,30.5 | v33,39 20,39 19,40
VBUS  (via drill 0.3)
  Top 0.152: v184.5,18 184.5,19 F1.2 184,19 181.5,19 v181.5,28 | v192.5,18 192.5,17 JP1.1 | 120,25 121,25 U$2.2 | 120,25 120,21.5 120.5,21 121,21 U$2.7 | v33,29.5 v33,23 | v119.5,31.5 119.5,25 120,25 | v134.5,31.5 v134.5,28
  Bottom 0.152: v192.5,18 v184.5,18 | v33,23 31,23 JP3.1 | v33,29.5 53.5,29.5 55,31 76,31 77,32 90.5,32 91,31.5 v119.5,31.5 120,31.5 120.5,32 125,32 125.5,31.5 v134.5,31.5 | v134.5,28 v181.5,28
VIN
  Top 0.152: 13.5,23 13.5,28 C11.+
  Top 1.676: D1.C 16.61,19.31 X1.2 10.68,22.18 11.5,23 13.5,23 25.4,23 JP3.3
(copper drawn outside any net)
  shapes: Bottom area x1, Top area x2

### Text on the board
tPlace: L | ON | RX | TX | 100M | FULL | LINK | Output1 | Output2 | Output3 | Output4 | Output5 | Output6 | D6 | 100M | D7 | D8 | D9 | D10 | D11 | D12 | D13 | SS | SCK | GND | VCC | MOSI | MISO | AD5 | AD4 | AD3 | AD2 | AD1 | AD0 | D5 | D4 | SCL | SDA | TX | RX
200bmp: CENTURION | Multi-Control System | Mother Board | LuxuryLogico.com